# EAGLE schematic EEZ PSU consolidated r5B8 (EAGLE 6.1), part 1 of 2
Assembly variants: Farnell, TME

## Sheet 1 of 12
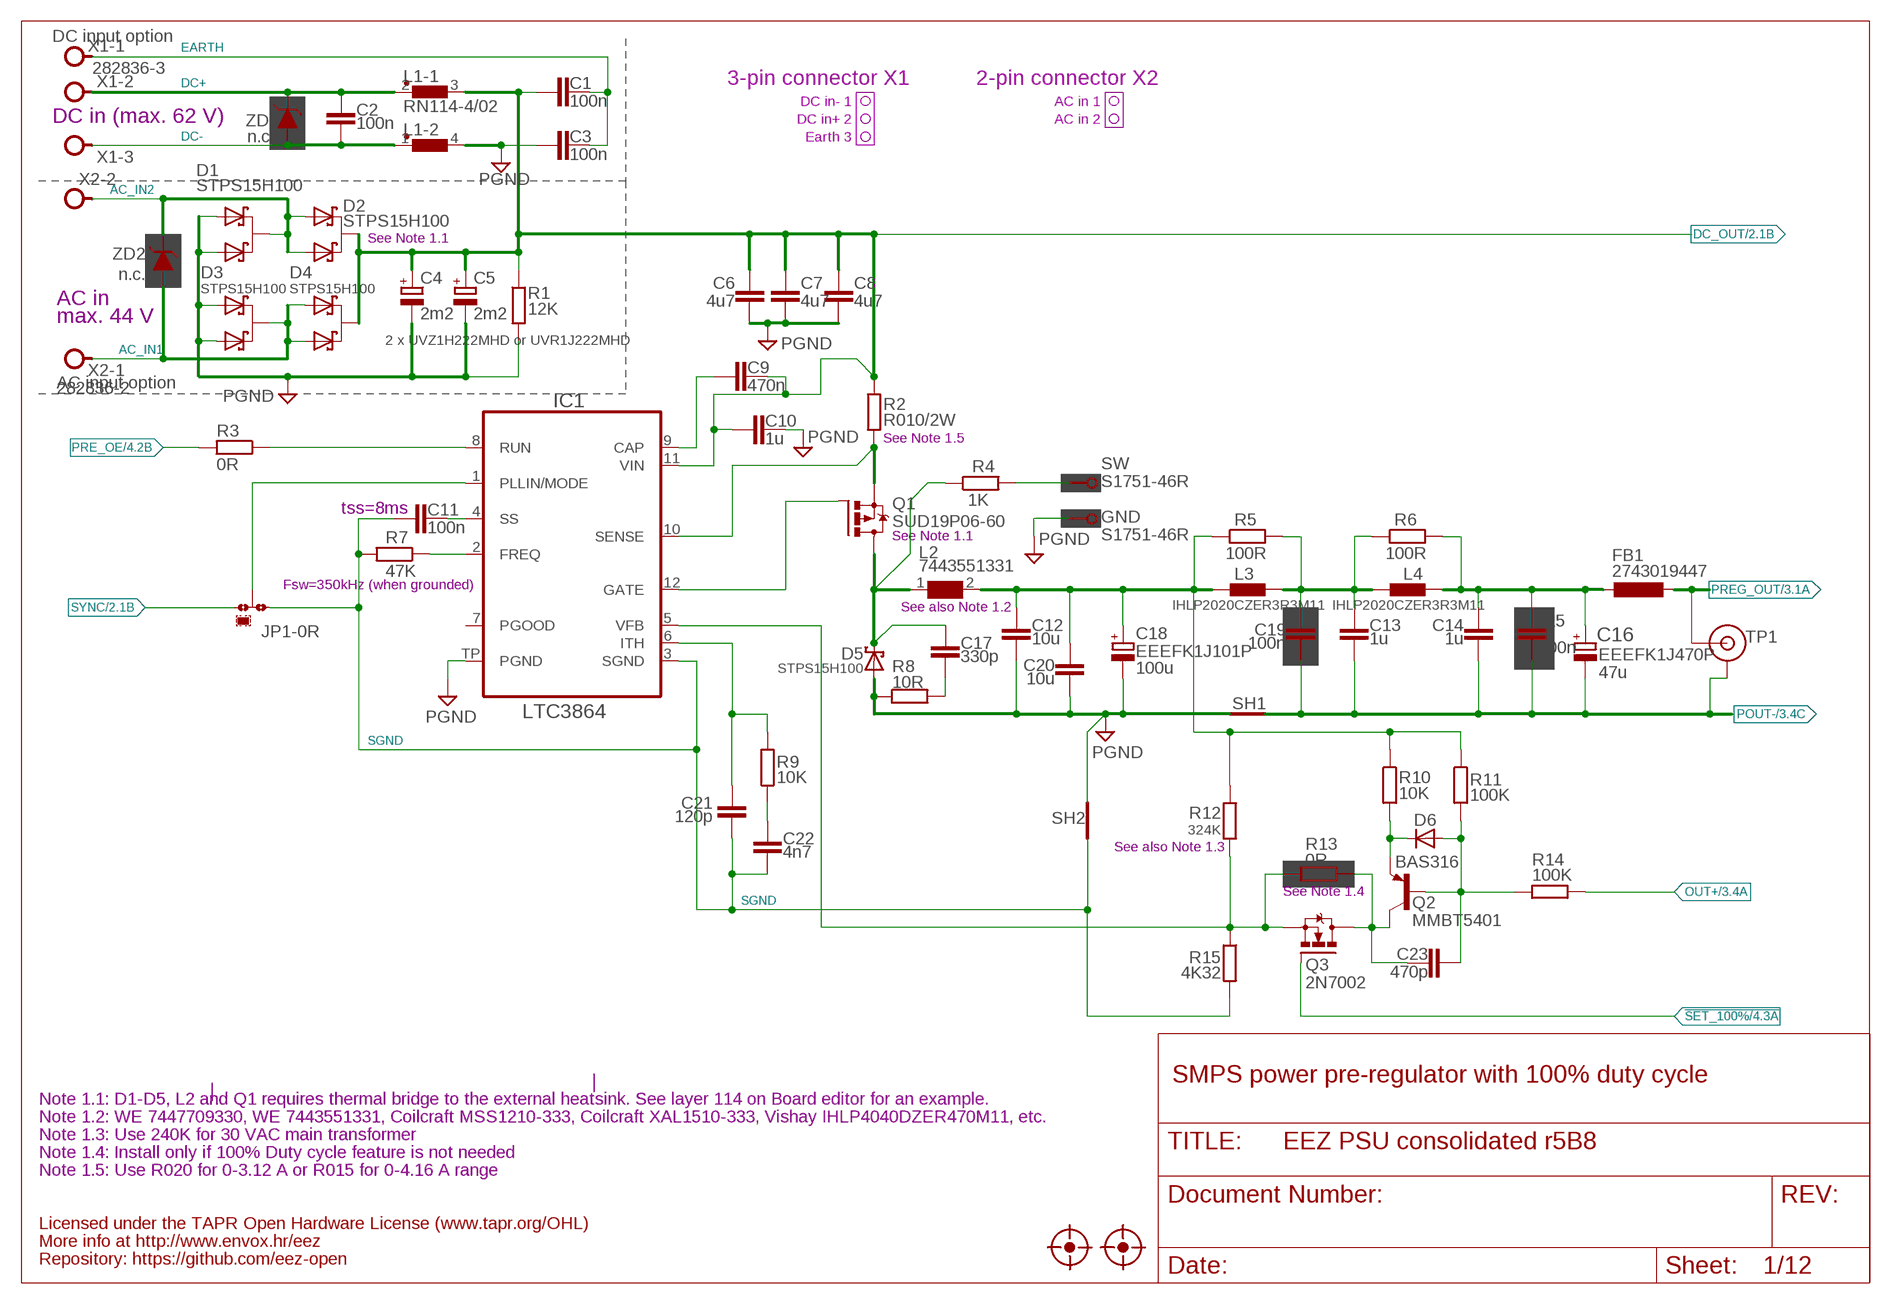
[diagram p0: schematic, sheet 1]

### Parts
C1  100n  C-EUC1206  [C1206]
C2  100n  C-EUC1206  [C1206]
C3  100n  C-EUC1206  [C1206]
C4  2m2  ECAP7.5G_18MM  [ECAP7.5/18]
C5  2m2  ECAP7.5G_18MM  [ECAP7.5/18]
C6  4u7  C-EUC1210  [C1210]
C7  4u7  C-EUC1210  [C1210]
C8  4u7  C-EUC1210  [C1210]
C9  470n  C-EUC0805  [C0805]
C10  1u  C-EUC1206  [C1206]
C11  100n  C-EUC0805  [C0805]
C12  10u  C-EUC1210  [C1210]
C13  1u  C-EUC1206  [C1206]
C14  1u  C-EUC1206  [C1206]
C15  100n  C-EUC0805  [C0805]
C16  EEEFK1J470P  EEE-FK1J470P-CASE-F  [CAPAE830X1050N]
C17  330p  C-EUC0805  [C0805]
C18  EEEFK1J101P  ECAPF  [PANASONIC_F]
C19  100n  C-EUC0805  [C0805]
C20  10u  C-EUC1210  [C1210]
C21  120p  C-EUC0805  [C0805]
C22  4n7  C-EUC0805  [C0805]
C23  470p  C-EUC0805  [C0805]
D1  STPS15H100  VS-6CWQ06FNPBF  [TO252@1]
D2  STPS15H100  VS-6CWQ06FNPBF  [TO252@1]
D3  STPS15H100  VS-6CWQ06FNPBF  [TO252@1]
D4  STPS15H100  VS-6CWQ06FNPBF  [TO252@1]
D5  STPS15H100  SCHOTTKYTO252  [TO252]
D6  BAS316  DIODE-SOD323-W  [SOD323-W]
FB1  2743019447  L-EUL1812  [L1812]
GND  S1751-46R  PCB_TEST_TABSMD  [S1751-46R]
IC1  LTC3864  [LTC_05-08-1666]
JP1  0R-JUMPA  [A0R-JMP]
L1  RN114-4/02  RN114  [RN114]
L2  7443551331  WE-HCI-7443551331_1350/1365  [WE-HCI_1350/1365]
L3  IHLP2020CZER3R3M11  IHLP-2020BZ-11  [IHLP-2020BZ-11]
L4  IHLP2020CZER3R3M11  IHLP-2020BZ-11  [IHLP-2020BZ-11]
Q1  SUD19P06-60  P-MOSFETDPAK  [TO229P990X239-3N]
Q2  MMBT5401  BC857B-PNP-SOT23-BEC  [SOT23-BEC]
Q3  2N7002  [SOT103P240X110-3N]
R1  12K  R-EU_R1206  [R1206]
R2  R010/2W  R-EU_R2512  [R2512]
R3  0R  R-EU_R0805  [R0805]
R4  1K  R-EU_R0805  [R0805]
R5  100R  R-EU_R0805  [R0805]
R6  100R  R-EU_R0805  [R0805]
R7  47K  R-EU_R0805  [R0805]
R8  10R  R-EU_R1206  [R1206]
R9  10K  R-EU_R0805  [R0805]
R10  10K  R-EU_R0805  [R0805]
R11  100K  R-EU_R0805  [R0805]
R12  324K  R-EU_R0805  [R0805]
R13  0R  R-EU_R0805  [R0805]
R14  100K  R-EU_R0805  [R0805]
R15  4K32  R-EU_R0805  [R0805]
SH1  Pgnd to Pout- short  SHORTNOHOLE  [SHORT_NOHOLE]
SH2  Sgnd to Pgnd short  SHORTNOHOLE  [SHORT_NOHOLE]
SW  S1751-46R  PCB_TEST_TABSMD  [S1751-46R]
TP1  TEST_POINT  [TP_1.1MM]
U$11  FIDUCIAL_2  [FIDUCIAL_DUAL]
U$12  FIDUCIAL_2  [FIDUCIAL_DUAL]
X1  282836-3  TBLOCK5.0_3A  [TBLOCK5.0_3]
X2  282836-2  TBLOCK5.0_2A  [TBLOCK5.0_2]
ZD1  n.c.  P6SMB68A  [DO214AA]
ZD2  n.c.  P6SMB68A  [DO214AA]

### Nets
!SET_100%: Q3.1(G) ; also sheet 4
AC_IN1: D3.3(C) D4.1(A1) D4.2(A2) X2.1 ZD2.A
AC_IN2: D1.3(C) D2.1(A1) D2.2(A2) X2.2 ZD2.C
DC+: C2.2 L1.2 X1.2 ZD1.C
DC-: C2.1 L1.1 X1.3 ZD1.A
DC_OUT: C1.2 C4.+ C5.+ C6.1 C7.1 C8.1 C9.2 C10.1 D2.3(C) D4.3(C) IC1.11(VIN) L1.3 R1.1 R2.1 ; also sheet 2,3
EARTH: C1.1 C3.2 X1.1 ; also sheet 8,10
FB: IC1.5(VFB) Q3.2(S) R12.2 R13.2 R15.1
GND [gnd]: C3.1 C4.- C5.- C6.2 C7.2 C8.2 C10.2 C12.2 C18.2(-) C20.2 D1.1(A1) D1.2(A2) D3.1(A1) D3.2(A2) D5.1(A) D5.2(A) GND.P$1 IC1.TP(PGND) L1.4 R1.2 R8.1 SH1.P$2(GND_B) SH2.P$2(GND_B) ; supply symbol labelled PGND ; also sheet 2,3,4,5,6,7,8,9,10,11,12
L_OUT: C12.1 C18.1(+) C20.1 L2.2 L3.1 R5.1 R10.1 R11.1 R12.1
MODE: IC1.1(PLLIN/MODE) JP1.2
N$7: R4.2 SW.P$1
N$19: D6.C Q2.E R10.2
N$20: C21.1 IC1.6(ITH) R9.2
N$21: C22.1 R9.1
N$23: C9.1 IC1.9(CAP)
N$30: IC1.12(GATE) Q1.1(G)
N$31: IC1.2(FREQ) R7.1
N$33: C11.2 IC1.4(SS)
N$34: C23.1 Q2.C Q3.3(D) R13.1
N$35: C13.1 C19.2 L3.2 L4.1 R5.2 R6.1
N$36: IC1.8(RUN) R3.1
N$38: C17.2 R8.2
N$79: C23.2 D6.A Q2.B R11.2 R14.1
OUT+: R14.2 ; also sheet 3,5
P_OUT: C14.1 C15.1 C16.1 FB1.1 L4.2 R6.2
POUT-: C13.2 C14.2 C15.2 C16.2 C19.1 SH1.P$1(GND_A) TP1.GND ; also sheet 3
PRE_OE: R3.2 ; also sheet 4
PREG_OUT: FB1.2 TP1.TIP ; also sheet 3
SENSE: IC1.10(SENSE) Q1.3(S) R2.2
SGND: C11.1 C21.2 C22.2 IC1.3(SGND) JP1.1 R7.2 R15.2 SH2.P$1(GND_A)
SW: C17.1 D5.3(C) L2.1 Q1.2(D) R4.1
SYNC: JP1.3 ; also sheet 2
Unconnected: IC1.7(PGOOD)

### Notes on the sheet
- DC input option
- 3-pin connector X1 | 2-pin connector X2
- DC in- 1 | AC in 1
- DC in+ 2 | AC in 2
- DC in (max. 62 V)
- Earth 3
- See Note 1.1
- AC in
- max. 44 V
- 2 x UVZ1H222MHD or UVR1J222MHD
- AC input option
- See Note 1.5
- tss=8ms
- See Note 1.1
- Fsw=350kHz (when grounded)
- See also Note 1.2
- 100u | 47u
- See also Note 1.3
- See Note 1.4
- SMPS power pre-regulator with 100% duty cycle
- Note 1.1: D1-D5, L2 and Q1 requires thermal bridge to the external heatsink. See layer 114 on Board editor for an example.
- Note 1.2: WE 7447709330, WE 7443551331, Coilcraft MSS1210-333, Coilcraft XAL1510-333, Vishay IHLP4040DZER470M11, etc.
- Note 1.3: Use 240K for 30 VAC main transformer
- Note 1.4: Install only if 100% Duty cycle feature is not needed
- Note 1.5: Use R020 for 0-3.12 A or R015 for 0-4.16 A range
- Licensed under the TAPR Open Hardware License (www.tapr.org/OHL)
- More info at http://www.envox.hr/eez
- Repository: https://github.com/eez-open

## Sheet 2 of 12
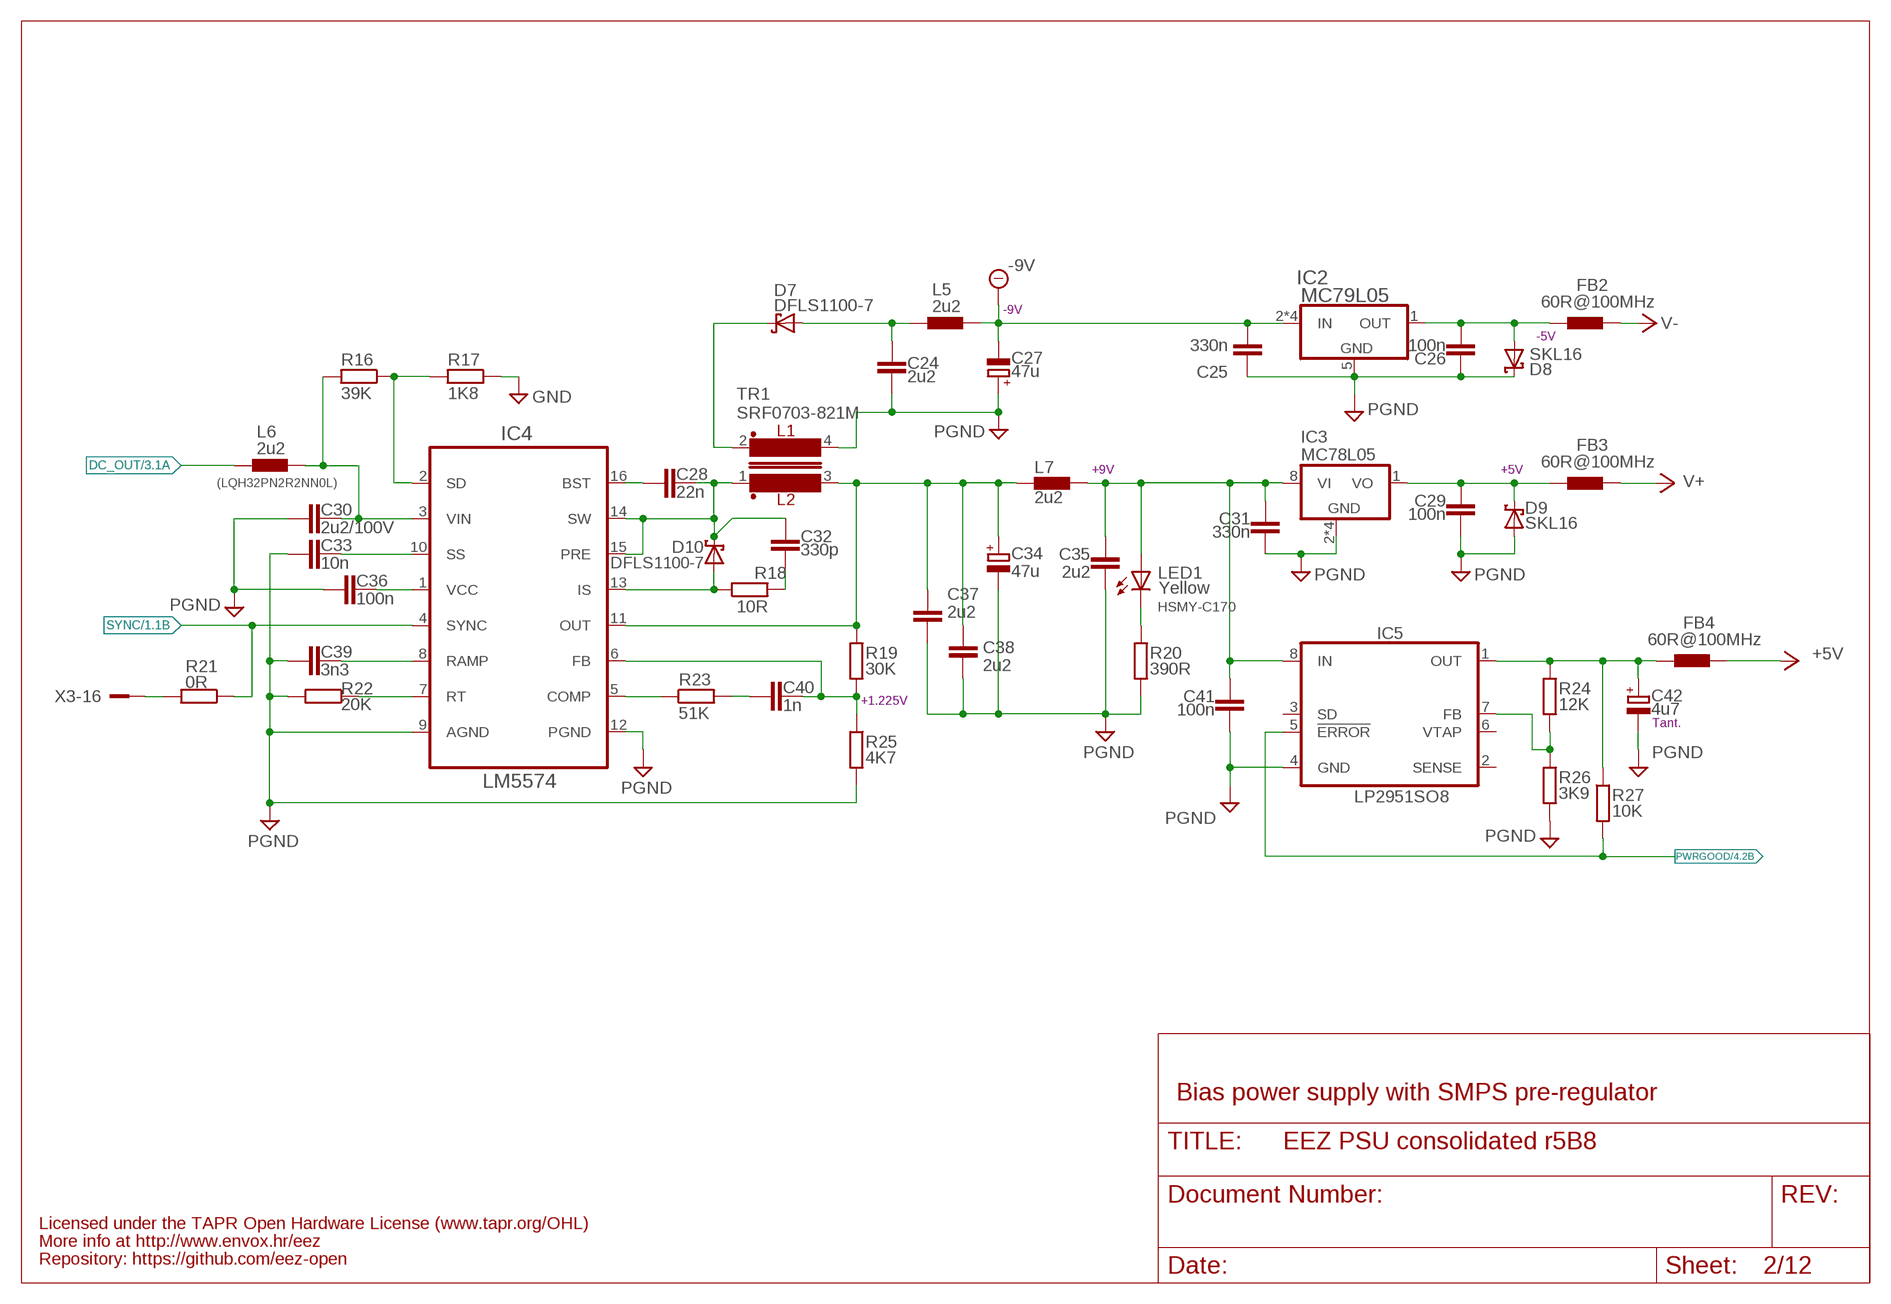
[diagram p1: schematic, sheet 2]

### Parts
C24  2u2  C-EUC0805  [C0805]
C25  330n  C-EUC0805  [C0805]
C26  100n  C-EUC0805  [C0805]
C27  47u  ECAPPANASONIC_H  [CAPAE660X610N]
C28  22n  C-EUC0805  [C0805]
C29  100n  C-EUC0805  [C0805]
C30  2u2/100V  C-EUC1210  [C1210]
C31  330n  C-EUC0805  [C0805]
C32  330p  C-EUC0805  [C0805]
C33  10n  C-EUC0805  [C0805]
C34  47u  ECAPPANASONIC_H  [CAPAE660X610N]
C35  2u2  C-EUC0805  [C0805]  (variant Farnell: 2320829)  (variant TME: CL21B225KAFNNNG )
C36  100n  C-EUC0805  [C0805]
C37  2u2  C-EUC0805  [C0805]  (variant Farnell: 2320829)  (variant TME: CL21B225KAFNNNG )
C38  2u2  C-EUC0805  [C0805]  (variant Farnell: 2320829)  (variant TME: CL21B225KAFNNNG )
C39  3n3  C-EUC0805  [C0805]
C40  1n  C-EUC0805  [C0805]
C41  100n  C-EUC0805  [C0805]
C42  4u7  ECAP1206  [EC1206]
D7  DFLS1100-7  SCHOTTKYSOD123  [SOD123]
D8  SKL16  SCHOTTKYSOD123  [SOD123]
D9  SKL16  SCHOTTKYSOD123  [SOD123]
D10  DFLS1100-7  SCHOTTKYSOD123  [SOD123]
FB2  60R@100MHz  FERRITE_BEAD0603  [BEAD0603]
FB3  60R@100MHz  FERRITE_BEAD0603  [BEAD0603]
FB4  60R@100MHz  FERRITE_BEAD0603  [BEAD0603]
IC2  MC79L05  MC79LXXSOIC  [SOIC127P600X173-8N]
IC3  MC78L05  MC78LXXSOIC8  [SOIC127P600X173-8N]
IC4  LM5574  [SOP65P640X110-16N]
IC5  LP2951SO8  [SOIC127P600X175-8N]
L5  2u2  L1210  [L1210]
L6  2u2  L1210  [L1210]
L7  2u2  L1210  [L1210]
LED1  HSMY-C170  LED0805  [LED_0805]
R16  39K  R-EU_R0805  [R0805]
R17  1K8  R-EU_R0805  [R0805]
R18  10R  R-EU_R1206  [R1206]
R19  30K  R-EU_R0805  [R0805]
R20  390R  R-EU_R0805  [R0805]
R21  0R  R-EU_R0805  [R0805]
R22  20K  R-EU_R0805  [R0805]
R23  51K  R-EU_R0805  [R0805]
R24  12K  R-EU_R0805  [R0805]
R25  4K7  R-EU_R0805  [R0805]
R26  3K9  R-EU_R0805  [R0805]
R27  10K  R-EU_R0805  [R0805]
TR1  SRF0703-821M  BOURNS_SRF0703INV  [SRF0703]
X3  SSW-113-02-T-D-RA  [SSW-113-02-T-D-RA]

### Nets
+5V: FB4.P$2 ; also sheet 3,4,5,6,7,8,9,10,11,12
+VNR: C31.1 C35.1 C41.1 IC3.8(VI) IC5.8(IN) L7.2 LED1.A
-9V: C25.2 C27.2(-) IC2.2(IN) IC2.3(IN) IC2.6(IN) IC2.7(IN) L5.2 ; also sheet 3
DC_OUT: L6.1 ; also sheet 1,3
DC_PREG1: C30.1 IC4.3(VIN) L6.2 R16.2
GND [gnd]: C24.2 C25.1 C26.1 C27.1(+) C29.2 C30.2 C31.2 C33.2 C34.2(-) C35.2 C36.1 C37.2 C38.2 C39.1 C41.2 C42.- D8.C D9.A IC2.5(GND) IC3.2(GND) IC3.3(GND) IC3.6(GND) IC3.7(GND) IC4.9(AGND) IC4.12(PGND) IC5.4(GND) R17.1 R20.2 R22.2 R25.2 R26.2 TR1.4 ; supply symbol labelled PGND ; also sheet 1,3,4,5,6,7,8,9,10,11,12
IS: D10.A IC4.13(IS) R18.1
N$4: C26.2 D8.A FB2.P$1 IC2.1(OUT)
N$5: C29.1 D9.C FB3.P$1 IC3.1(VO)
N$6: C42.+ FB4.P$1 IC5.1(OUT) R24.1 R27.1
N$24: R21.2 X3.16
N$43: LED1.C R20.1
N$46: C32.2 R18.2
N$64: IC5.7(FB) R24.2 R26.1
N$77: C40.2 R23.2
N$128: C40.1 IC4.6(FB) R19.2 R25.1
N$131: C28.2 IC4.16(BST)
N$135: IC4.5(COMP) R23.1
N$165: IC4.7(RT) R22.1
N$166: C36.2 IC4.1(VCC)
N$167: C39.2 IC4.8(RAMP)
N$168: C33.1 IC4.10(SS)
N$179: C24.1 D7.A L5.1
N$180: IC4.2(SD) R16.1 R17.2
PWRGOOD: IC5.5(!ERROR) R27.2 ; also sheet 4
SW1: C28.1 C32.1 D10.C IC4.14(SW) IC4.15(PRE) TR1.1
SYNC: IC4.4(SYNC) R21.1 ; also sheet 1
V+: FB3.P$2 ; also sheet 3,4,5
V-: FB2.P$2 ; also sheet 3,4,5
VOUT+: C34.1(+) C37.1 C38.1 IC4.11(OUT) L7.1 R19.1 TR1.3
VOUT-: D7.C TR1.2
Unconnected: IC5.2(SENSE) IC5.3(SD) IC5.6(VTAP)

### Notes on the sheet
- -9V
- -5V
- +9V | +5V
- (LQH32PN2R2NN0L)
- Yellow
- +1.225V
- Tant.
- Bias power supply with SMPS pre-regulator
- Licensed under the TAPR Open Hardware License (www.tapr.org/OHL)
- More info at http://www.envox.hr/eez
- Repository: https://github.com/eez-open

## Sheet 3 of 12
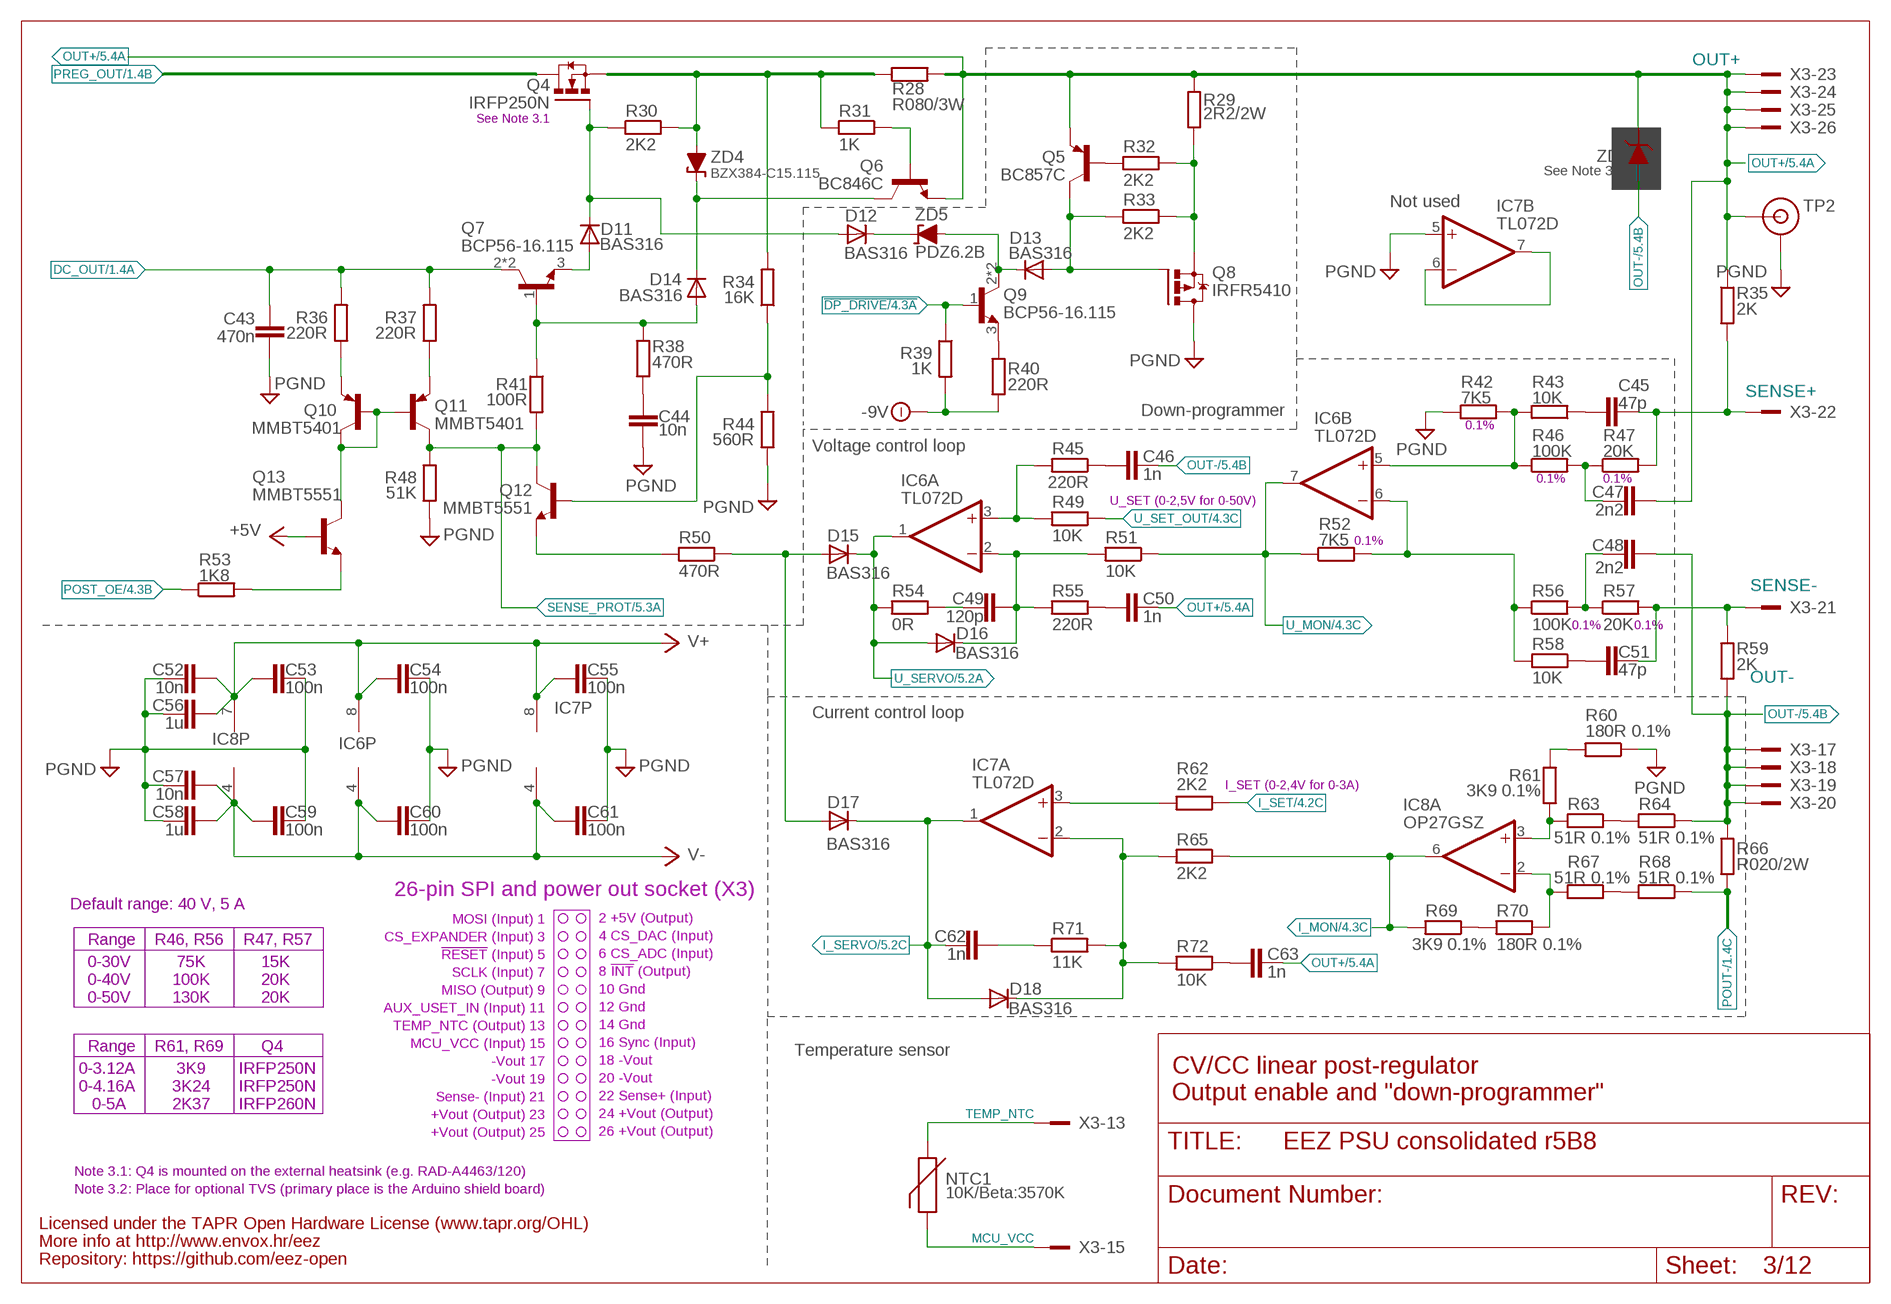
[diagram p2: schematic, sheet 3]

### Parts
C43  470n  C-EUC1812  [C1812]
C44  10n  C-EUC0805  [C0805]
C45  47p  C-EUC0805  [C0805]
C46  1n  C-EUC0805  [C0805]
C47  2n2  C-EUC0805  [C0805]
C48  2n2  C-EUC0805  [C0805]
C49  120p  C-EUC0805  [C0805]
C50  1n  C-EUC0805  [C0805]
C51  47p  C-EUC0805  [C0805]
C52  10n  C-EUC0805  [C0805]
C53  100n  C-EUC0603  [C0603]
C54  100n  C-EUC0603  [C0603]
C55  100n  C-EUC0603  [C0603]
C56  1u  C-EUC0805  [C0805]
C57  10n  C-EUC0805  [C0805]
C58  1u  C-EUC0805  [C0805]
C59  100n  C-EUC0603  [C0603]
C60  100n  C-EUC0603  [C0603]
C61  100n  C-EUC0603  [C0603]
C62  1n  C-EUC0805  [C0805]
C63  1n  C-EUC0805  [C0805]
D11  BAS316  DIODE-SOD323-W  [SOD323-W]
D12  BAS316  DIODE-SOD323-W  [SOD323-W]
D13  BAS316  DIODE-SOD323-W  [SOD323-W]
D14  BAS316  DIODE-SOD323-W  [SOD323-W]
D15  BAS316  DIODE-SOD323-W  [SOD323-W]
D16  BAS316  DIODE-SOD323-W  [SOD323-W]
D17  BAS316  DIODE-SOD323-W  [SOD323-W]
D18  BAS316  DIODE-SOD323-W  [SOD323-W]
IC6  TL072D  TL072SOIC8  [SOIC127P600X173-8N]
IC7  TL072D  TL072SOIC8  [SOIC127P600X173-8N]
IC8  OP27GSZ  OP27GSZSO8  [SOIC127P600X173-8N]
NTC1  10K/Beta:3570K  NTC0805  [R_0204/5+0805]
Q4  IRFP250N  IRFP240BOTTOM  [TO247BH-CLR]
Q5  BC857C  BC857C-PNP-SOT23-BEC  [SOT23-BEC]
Q6  BC846C  BC846B-NPN-SOT23-BEC  [SOT23-BEC]
Q7  BCP56-16.115  BCP56  [SOT230P700X180-4N]
Q8  IRFR5410  P-MOSFETDPAK  [TO229P990X239-3N]
Q9  BCP56-16.115  BCP56  [SOT230P700X180-4N]
Q10  MMBT5401  BC857B-PNP-SOT23-BEC  [SOT23-BEC]
Q11  MMBT5401  BC857B-PNP-SOT23-BEC  [SOT23-BEC]
Q12  MMBT5551  MMBT5551LT1-NPN-SOT23-BEC  [SOT23-BEC]
Q13  MMBT5551  MMBT5551LT1-NPN-SOT23-BEC  [SOT23-BEC]
R28  R080/3W  R-EU_R2512  [R2512]
R29  2R2/2W  R-EU_R2512  [R2512]
R30  2K2  R-EU_R0805  [R0805]
R31  1K  R-EU_R0805  [R0805]
R32  2K2  R-EU_R0805  [R0805]
R33  2K2  R-EU_R0805  [R0805]
R34  16K  R-EU_R0805  [R0805]
R35  2K  R-EU_R0805  [R0805]
R36  220R  R-EU_R0805  [R0805]
R37  220R  R-EU_R0805  [R0805]
R38  470R  R-EU_R0805  [R0805]
R39  1K  R-EU_R0805  [R0805]
R40  220R  R-EU_R0805  [R0805]
R41  100R  R-EU_R0805  [R0805]
R42  7K5  R-EU_R0805  [R0805]
R43  10K  R-EU_R0805  [R0805]
R44  560R  R-EU_R0805  [R0805]
R45  220R  R-EU_R0805  [R0805]
R46  100K  R-EU_R0805  [R0805]
R47  20K  R-EU_R0805  [R0805]
R48  51K  R-EU_R0805  [R0805]
R49  10K  R-EU_R0805  [R0805]
R50  470R  R-EU_R0805  [R0805]
R51  10K  R-EU_R0805  [R0805]
R52  7K5  R-EU_R0805  [R0805]
R53  1K8  R-EU_R0805  [R0805]
R54  0R  R-EU_R0805  [R0805]
R55  220R  R-EU_R0805  [R0805]
R56  100K  R-EU_R0805  [R0805]
R57  20K  R-EU_R0805  [R0805]
R58  10K  R-EU_R0805  [R0805]
R59  2K  R-EU_R0805  [R0805]
R60  180R 0.1%  R-EU_R0805  [R0805]
R61  3K9 0.1%  R-EU_R0805  [R0805]
R62  2K2  R-EU_R0805  [R0805]
R63  51R 0.1%  R-EU_R0805  [R0805]
R64  51R 0.1%  R-EU_R0805  [R0805]
R65  2K2  R-EU_R0805  [R0805]
R66  R020/2W  R-EU_R2512  [R2512]
R67  51R 0.1%  R-EU_R0805  [R0805]
R68  51R 0.1%  R-EU_R0805  [R0805]
R69  3K9 0.1%  R-EU_R0805  [R0805]
R70  180R 0.1%  R-EU_R0805  [R0805]
R71  11K  R-EU_R0805  [R0805]
R72  10K  R-EU_R0805  [R0805]
TP2  TEST_POINT  [TP_1.1MM]
ZD3  See Note 3.2  P6SMB68A  [DO214AA]
ZD4  BZX384-C15.115  ZENER-DIODESOD323  [SOD323-W]
ZD5  PDZ6.2B  ZENER-DIODESOD323  [SOD323-W]

### Nets
!DP_DRIVE: Q9.1(B) R39.1 ; also sheet 4
+5V: Q13.B ; also sheet 2,4,5,6,7,8,9,10,11,12
-9V: R39.2 R40.2 ; also sheet 2
DC_OUT: C43.1 Q7.2(C) Q7.4(C) R36.2 R37.2 ; also sheet 1,2
GND [gnd]: C43.2 C44.2 C52.1 C53.2 C54.1 C55.1 C56.1 C57.1 C58.1 C59.2 C60.1 C61.1 IC7.5(B:+IN) Q8.2(D) R42.1 R44.1 R48.1 R60.1 TP2.GND ; supply symbol labelled PGND ; also sheet 1,2,4,5,6,7,8,9,10,11,12
I_MON: IC8.6(A:OUT) R65.1 R69.2 ; also sheet 4
I_SERVO: C62.2 D17.C D18.A IC7.1(A:OUT) ; also sheet 5
I_SET: R62.1 ; also sheet 4
ISENSE+: IC8.3(A:+IN) R61.2 R63.2
ISENSE-: IC8.2(A:-IN) R67.2 R70.1
MCU_VCC: NTC1.2 NTC1.2.1 X3.15
N$1: Q9.3(E) R40.1
N$2: Q5.B R32.2
N$3: C45.2 R43.1
N$8: R63.1 R64.2
N$10: C51.2 R58.1
N$13: R67.1 R68.2
N$14: R69.1 R70.2
N$15: R60.2 R61.1
N$16: IC7.6(B:-IN) IC7.7(B:OUT)
N$17: C48.1 R56.2 R57.1
N$18: C49.2 R54.1
N$22: C63.2 R72.1
N$26: C46.2 R45.1
N$27: C50.2 R55.1
N$29: IC6.3(A:+IN) R45.2 R49.2
N$32: C49.1 D16.C IC6.2(A:-IN) R51.2 R55.2
N$37: D18.C IC7.2(A:-IN) R65.2 R71.2 R72.2
N$44: Q12.B R34.1 R44.2
N$50: IC7.3(A:+IN) R62.2
N$54: D15.A D17.A R50.1
N$56: D11.C D12.A Q4.G R30.1
N$62: D11.A Q7.3(E)
N$65: D14.A Q7.1(B) R38.2 R41.1
N$67: C44.1 R38.1
N$117: C47.1 R46.2 R47.1
N$129: D14.C Q6.C ZD4.C
N$143: D12.C ZD5.C
N$145: Q12.E R50.2
N$146: Q8.3(S) R29.1 R32.1 R33.1
N$147: D13.A Q5.C Q8.1(G) R33.2
N$150: IC6.5(B:+IN) R42.2 R43.2 R46.1
N$158: IC6.6(B:-IN) R52.2 R56.1 R58.2
N$172: C62.1 R71.1
N$183: Q11.E R37.1
N$184: Q10.E R36.1
N$186: Q13.E R53.2
N$201: Q6.B R31.1
OUT+: C47.2 C50.1 C63.1 Q5.E Q6.E R28.2 R29.2 R35.1 TP2.TIP X3.23 X3.24 X3.25 X3.26 ZD3.C ; also sheet 1,5
OUT-: C46.1 C48.2 R59.2 R64.1 R66.1 X3.17 X3.18 X3.19 X3.20 ZD3.A ; also sheet 5
POST_OE: R53.1 ; also sheet 4
POUT-: R66.2 R68.1 ; also sheet 1
PREG_OUT: Q4.D ; also sheet 1
Q4_OUT: Q4.S R28.1 R30.2 R31.2 R34.2 ZD4.A
Q7C: Q10.B Q10.C Q11.B Q13.C
Q9C: D13.C Q9.2(C) Q9.4(C) ZD5.A
SENSE+: C45.1 R35.2 R47.2 X3.22 ; also sheet 5
SENSE-: C51.1 R57.2 R59.1 X3.21 ; also sheet 5
SENSE_PROT: Q11.C Q12.C R41.2 R48.2 ; also sheet 5
TEMP_NTC: NTC1.1 NTC1.1.1 X3.13
U_MON: IC6.7(B:OUT) R51.1 R52.1 ; also sheet 4
U_SERVO: D15.C D16.A IC6.1(A:OUT) R54.2 ; also sheet 5
U_SET_OUT: R49.1 ; also sheet 4
V+: C52.2 C53.1 C54.2 C55.2 C56.2 IC6.8(P:V+) IC7.8(P:V+) IC8.7(P:V+) ; also sheet 2,4,5
V-: C57.2 C58.2 C59.1 C60.2 C61.2 IC6.4(P:V-) IC7.4(P:V-) IC8.4(P:V-) ; also sheet 2,4,5

### Notes on the sheet
- See Note 3.1
- Not used
- Down-programmer
- 0.1%
- Voltage control loop
- 0.1% | 0.1%
- U_SET (0-2,5V for 0-50V)
- 0.1%
- 0.1% | 0.1%
- Current control loop
- I_SET (0-2,4V for 0-3A)
- 26-pin SPI and power out socket (X3)
- Default range: 40 V, 5 A
- MOSI (Input) 1
- 2 +5V (Output)
- CS_EXPANDER (Input) 3
- 4 CS_DAC (Input)
- Range | R46, R56 | R47, R57
- !RESET! (Input) 5
- 6 CS_ADC (Input)
- 0-30V | 75K | 15K | SCLK (Input) 7
- 8 !INT! (Output)
- 0-40V | 100K | 20K | MISO (Output) 9
- 10 Gnd
- 0-50V | 130K | 20K | AUX_USET_IN (Input) 11
- 12 Gnd
- TEMP_NTC (Output) 13
- 14 Gnd
- MCU_VCC (Input) 15
- 16 Sync (Input)
- Range | R61, R69 | Q4
- -Vout 17 | Temperature sensor
- 18 -Vout
- 0-3.12A | 3K9 | IRFP250N | -Vout 19 | CV/CC linear post-regulator
- 20 -Vout
- 0-4.16A | 3K24 | IRFP250N | Sense- (Input) 21
- 22 Sense+ (Input) | Output enable and "down-programmer"
- 0-5A | 2K37 | IRFP260N | +Vout (Output) 23
- 24 +Vout (Output)
- +Vout (Output) 25
- 26 +Vout (Output)
- Note 3.1: Q4 is mounted on the external heatsink (e.g. RAD-A4463/120)
- Note 3.2: Place for optional TVS (primary place is the Arduino shield board)
- Licensed under the TAPR Open Hardware License (www.tapr.org/OHL)
- More info at http://www.envox.hr/eez
- Repository: https://github.com/eez-open

## Sheet 4 of 12
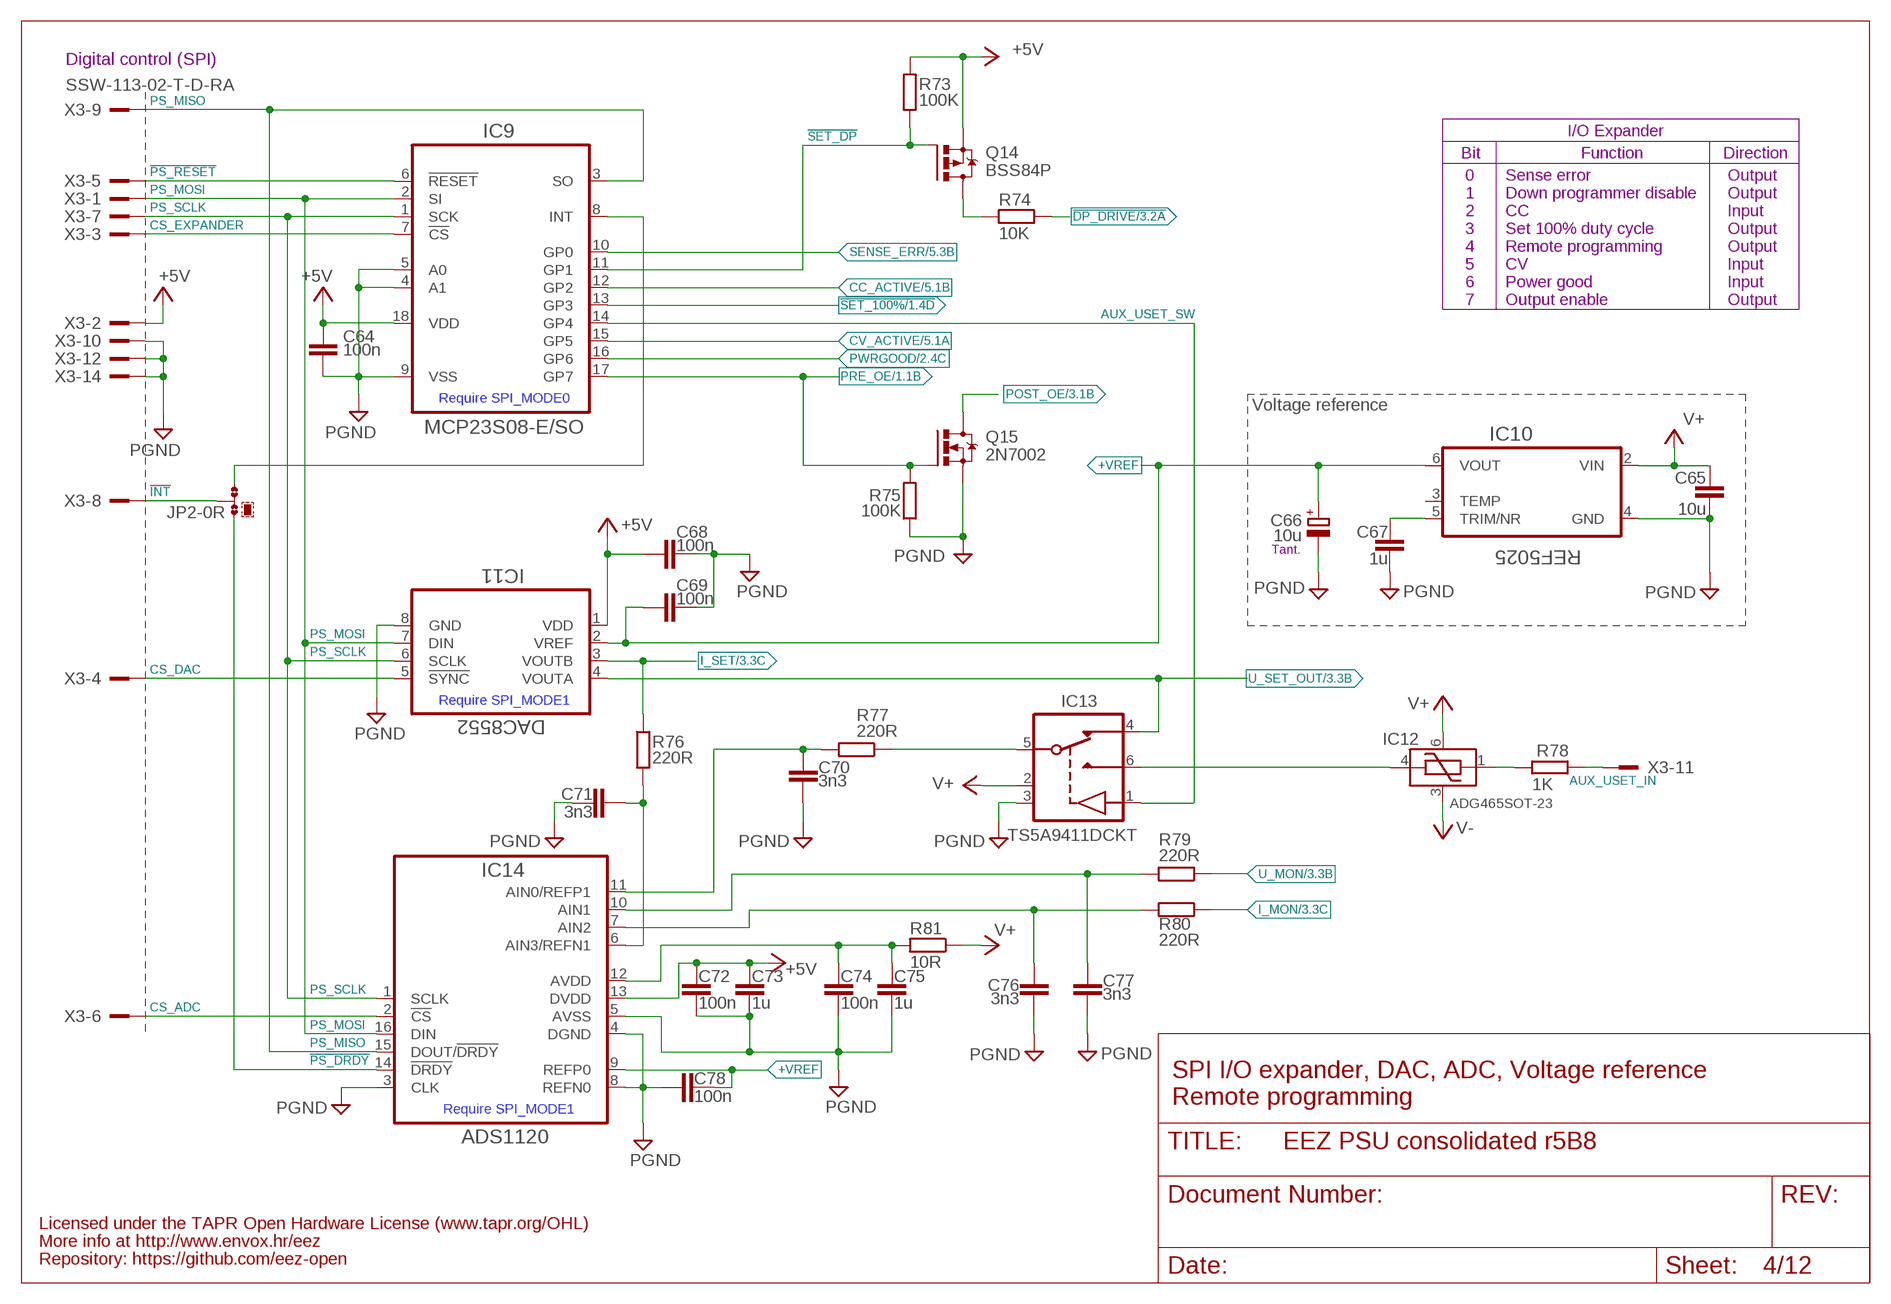
[diagram p3: schematic, sheet 4]

### Parts
C64  100n  C-EUC0603  [C0603]
C65  10u  C-EUC1206  [C1206]
C66  10u  ECAP1206  [EC1206]
C67  1u  C-EUC0805  [C0805]
C68  100n  C-EUC0603  [C0603]
C69  100n  C-EUC0603  [C0603]
C70  3n3  C-EUC0805  [C0805]
C71  3n3  C-EUC0805  [C0805]
C72  100n  C-EUC0603  [C0603]
C73  1u  C-EUC0805  [C0805]
C74  100n  C-EUC0603  [C0603]
C75  1u  C-EUC0805  [C0805]
C76  3n3  C-EUC0805  [C0805]
C77  3n3  C-EUC0805  [C0805]
C78  100n  C-EUC0603  [C0603]
IC9  MCP23S08-E/SO  MCP23S08  [SOIC127P1030X265-18N]
IC10  REF5025  REF50XX  [SOIC127P600X175-8N]
IC11  DAC8552  DAC8552_DGK_8M  [DGK8-M]
IC12  ADG465SOT-23  [SOT95P280X145-6N]
IC13  TS5A9411DCKT  [SOT65P210X110-6N]
IC14  ADS1120  ADS1120TSSOP-16  [PW(R-PDSO-G16)]
JP2  0R-JUMPA  [A0R-JMP]
Q14  BSS84P  IRLML2246TRPBF  [SOT95P237X112-3N]
Q15  2N7002  [SOT103P240X110-3N]
R73  100K  R-EU_R0805  [R0805]
R74  10K  R-EU_R0805  [R0805]
R75  100K  R-EU_R0805  [R0805]
R76  220R  R-EU_R0805  [R0805]
R77  220R  R-EU_R0805  [R0805]
R78  1K  R-EU_R0805  [R0805]
R79  220R  R-EU_R0805  [R0805]
R80  220R  R-EU_R0805  [R0805]
R81  10R  R-EU_R0805  [R0805]

### Nets
!DP_DRIVE: R74.1 ; also sheet 3
!INT: JP2.2 X3.8
!PS_DRDY: IC14.14(!DRDY) JP2.3
!PS_RESET: IC9.6(!RESET) X3.5
!SET_100%: IC9.13(GP3) ; also sheet 1
!SET_DP: IC9.11(GP1) Q14.1(G) R73.2
+5V: C64.1 C68.2 C72.2 C73.2 IC9.18(VDD) IC11.1(VDD) IC14.13(DVDD) Q14.2(S) R73.1 X3.2 ; also sheet 2,3,5,6,7,8,9,10,11,12
+VREF: C66.+ C69.2 C78.2 IC10.6(VOUT) IC11.2(VREF) IC14.9(REFP0)
AUX_USET_IN: R78.2 X3.11
AUX_USET_SW: IC9.14(GP4) IC13.1(IN)
CC_ACTIVE: IC9.12(GP2) ; also sheet 5
CS_ADC: IC14.2(!CS) X3.6
CS_DAC: IC11.5(!SYNC) X3.4
CS_EXPANDER: IC9.7(!CS) X3.3
CV_ACTIVE: IC9.15(GP5) ; also sheet 5
DP_LED: Q14.3(D) R74.2
GND [gnd]: C64.2 C65.2 C66.- C67.2 C68.1 C69.1 C70.1 C71.2 C72.1 C73.1 C74.1 C75.1 C76.1 C77.1 C78.1 IC9.4(A1) IC9.5(A0) IC9.9(VSS) IC10.4(GND) IC11.8(GND) IC13.3(GND) IC14.3(CLK) IC14.4(DGND) IC14.5(AVSS) IC14.8(REFN0) Q15.2(S) R75.1 X3.10 X3.12 X3.14 ; supply symbol labelled PGND ; also sheet 1,2,3,5,6,7,8,9,10,11,12
I_MON: R80.1 ; also sheet 3
I_SET: IC11.3(VOUTB) R76.1 ; also sheet 3
INT_EXP: IC9.8(INT) JP2.1
N$9: IC12.4(VS) IC13.6(S1)
N$11: C67.1 IC10.5(TRIM/NR)
N$12: IC12.1(VD) R78.1
N$28: C77.2 IC14.10(AIN1) R79.2
N$41: C70.2 IC14.11(AIN0/REFP1) R77.2
N$42: C74.2 C75.2 IC14.12(AVDD) R81.2
N$51: C71.1 IC14.6(AIN3/REFN1) R76.2
N$55: C76.2 IC14.7(AIN2) R80.2
POST_OE: Q15.3(D) ; also sheet 3
PRE_OE: IC9.17(GP7) Q15.1(G) R75.2 ; also sheet 1
PS_MISO: IC9.3(SO) IC14.15(DOUT/!DRDY) X3.9
PS_MOSI: IC9.2(SI) IC11.7(DIN) IC14.16(DIN) X3.1
PS_SCLK: IC9.1(SCK) IC11.6(SCLK) IC14.1(SCLK) X3.7
PWRGOOD: IC9.16(GP6) ; also sheet 2
SENSE_ERR: IC9.10(GP0) ; also sheet 5
U_MON: R79.1 ; also sheet 3
U_SET: IC13.5(D) R77.1
U_SET_OUT: IC11.4(VOUTA) IC13.4(S2) ; also sheet 3
V+: C65.1 IC10.2(VIN) IC12.6(VDD) IC13.2(VDD) R81.1 ; also sheet 2,3,5
V-: IC12.3(VSS) ; also sheet 2,3,5
Unconnected: IC10.3(TEMP)

### Notes on the sheet
- Digital control (SPI)
- I/O Expander
- Bit | Function | Direction
- 0 | Sense error | Output
- 1 | Down programmer disable | Output
- 2 | CC | Input
- 3 | Set 100% duty cycle | Output
- 4 | Remote programming | Output
- 5 | CV | Input
- 6 | Power good | Input
- 7 | Output enable | Output
- Voltage reference
- Require SPI_MODE0
- Tant.
- Require SPI_MODE1
- SPI I/O expander, DAC, ADC, Voltage reference
- Remote programming
- Require SPI_MODE1
- Licensed under the TAPR Open Hardware License (www.tapr.org/OHL)
- More info at http://www.envox.hr/eez
- Repository: https://github.com/eez-open

## Sheet 5 of 12
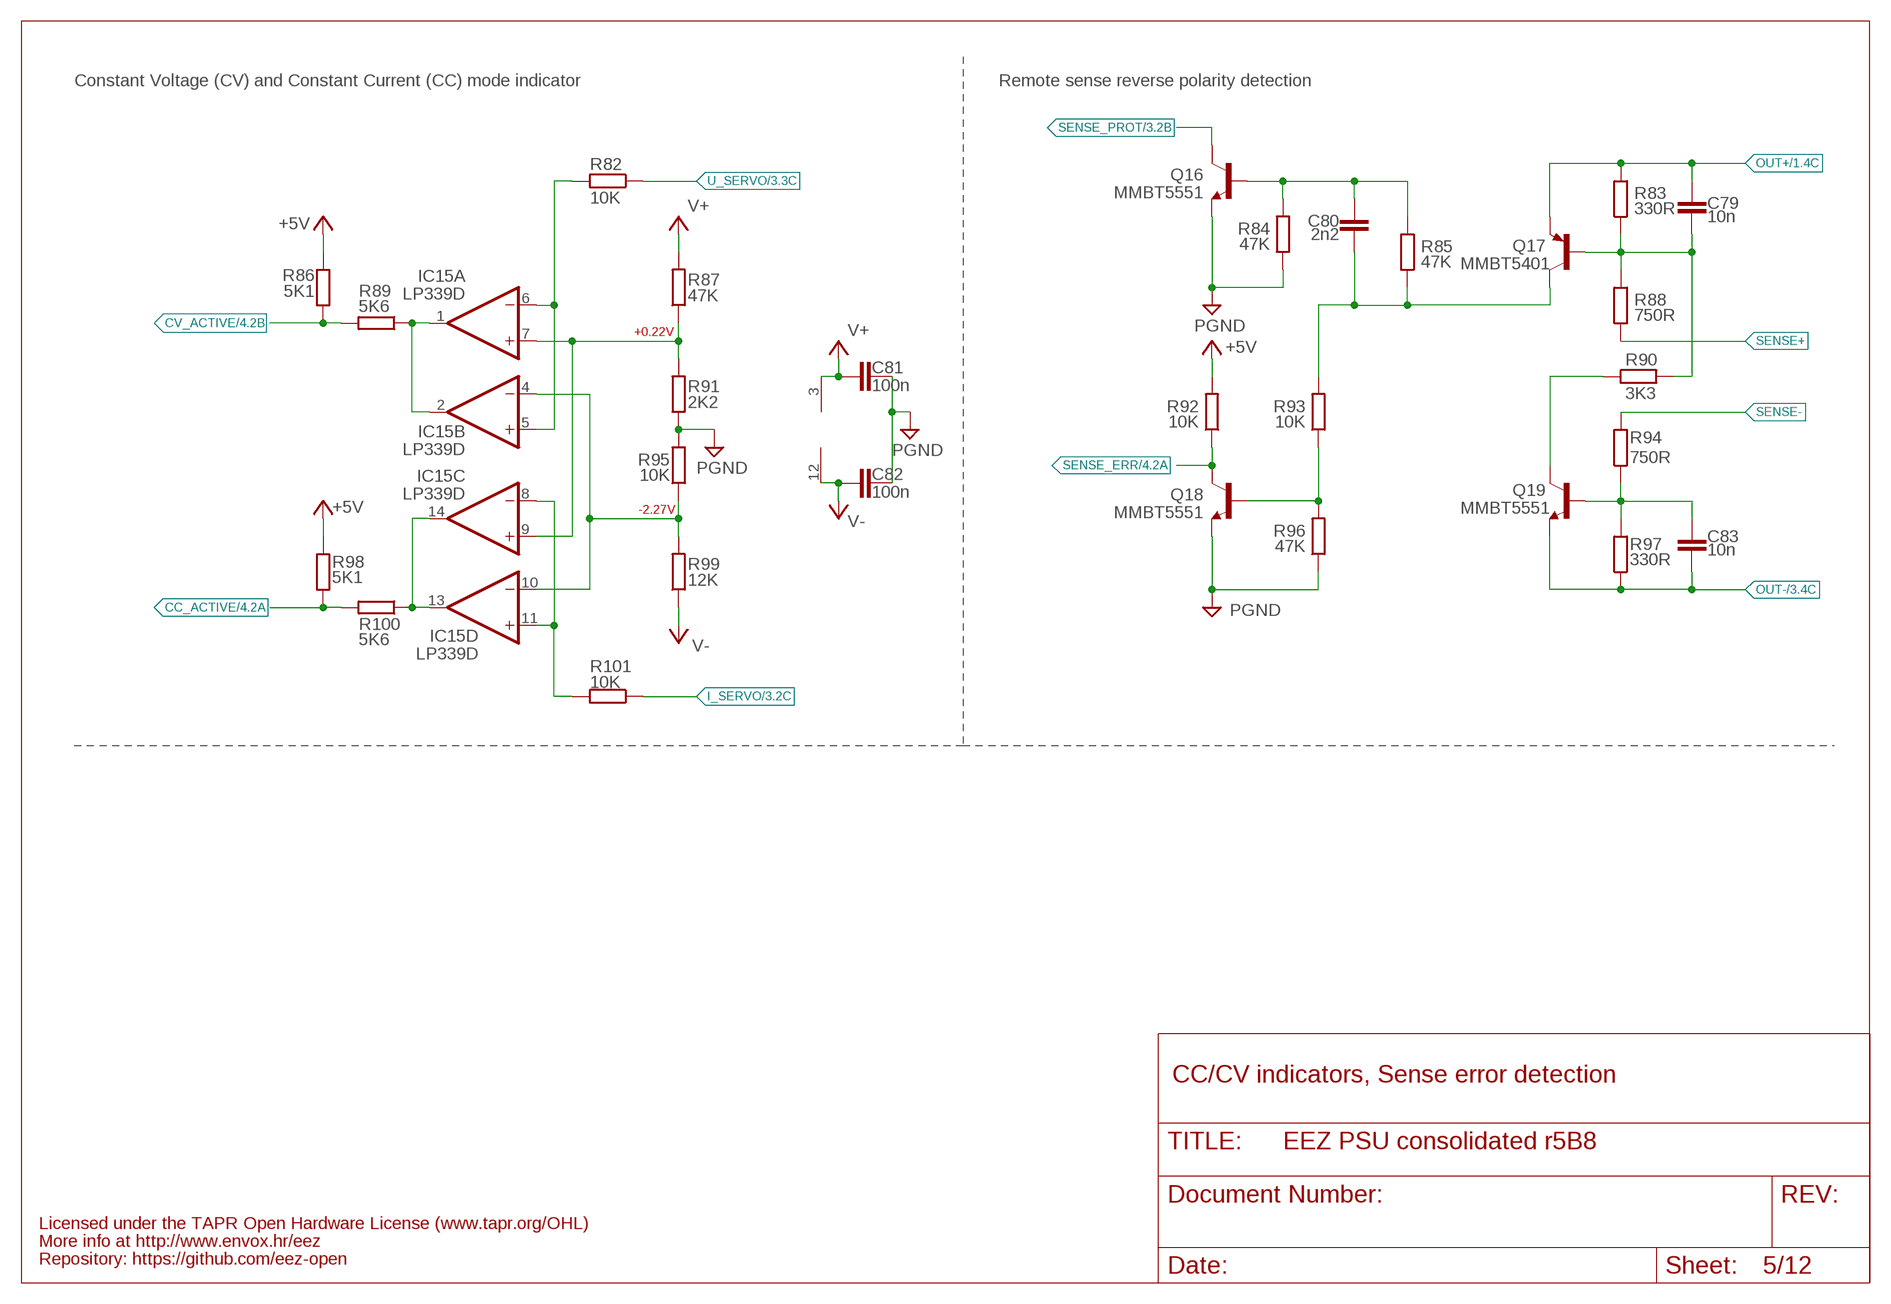
[diagram p4: schematic, sheet 5]

### Parts
C79  10n  C-EUC0805  [C0805]
C80  2n2  C-EUC0805  [C0805]
C81  100n  C-EUC0603  [C0603]
C82  100n  C-EUC0603  [C0603]
C83  10n  C-EUC0805  [C0805]
IC15  LP339D  LM339SO14  [SOIC127P600X175-14N]
Q16  MMBT5551  MMBT5551LT1-NPN-SOT23-BEC  [SOT23-BEC]
Q17  MMBT5401  BC857B-PNP-SOT23-BEC  [SOT23-BEC]
Q18  MMBT5551  MMBT5551LT1-NPN-SOT23-BEC  [SOT23-BEC]
Q19  MMBT5551  MMBT5551LT1-NPN-SOT23-BEC  [SOT23-BEC]
R82  10K  R-EU_R0805  [R0805]
R83  330R  R-EU_R0805  [R0805]
R84  47K  R-EU_R0805  [R0805]
R85  47K  R-EU_R0805  [R0805]
R86  5K1  R-EU_R0805  [R0805]
R87  47K  R-EU_R0805  [R0805]
R88  750R  R-EU_R0805  [R0805]
R89  5K6  R-EU_R0805  [R0805]
R90  3K3  R-EU_R0805  [R0805]
R91  2K2  R-EU_R0805  [R0805]
R92  10K  R-EU_R0805  [R0805]
R93  10K  R-EU_R0805  [R0805]
R94  750R  R-EU_R0805  [R0805]
R95  10K  R-EU_R0805  [R0805]
R96  47K  R-EU_R0805  [R0805]
R97  330R  R-EU_R0805  [R0805]
R98  5K1  R-EU_R0805  [R0805]
R99  12K  R-EU_R0805  [R0805]
R100  5K6  R-EU_R0805  [R0805]
R101  10K  R-EU_R0805  [R0805]

### Nets
+5V: R86.2 R92.2 R98.2 ; also sheet 2,3,4,6,7,8,9,10,11,12
CC_ACTIVE: R98.1 R100.2 ; also sheet 4
CV_ACTIVE: R86.1 R89.2 ; also sheet 4
GND [gnd]: C81.1 C82.1 Q16.E Q18.E R84.1 R91.1 R95.2 R96.1 ; supply symbol labelled PGND ; also sheet 1,2,3,4,6,7,8,9,10,11,12
I_SERVO: R101.1 ; also sheet 3
N$25: C79.2 Q17.B R83.1 R88.2 R90.2
N$39: Q18.B R93.1 R96.2
N$40: C80.2 Q17.C R85.1 R93.2
N$45: IC15.1(A:OUT) IC15.2(B:OUT) R89.1
N$47: Q19.C R90.1
N$48: IC15.13(D:OUT) IC15.14(C:OUT) R100.1
N$49: C83.1 Q19.B R94.1 R97.2
N$53: C80.1 Q16.B R84.2 R85.2
N$153: IC15.5(B:+IN) IC15.6(A:-IN) R82.2
N$161: IC15.8(C:-IN) IC15.11(D:+IN) R101.2
N$170: IC15.7(A:+IN) IC15.9(C:+IN) R87.1 R91.2
N$177: IC15.4(B:-IN) IC15.10(D:-IN) R95.1 R99.2
OUT+: C79.1 Q17.E R83.2 ; also sheet 1,3
OUT-: C83.2 Q19.E R97.1 ; also sheet 3
SENSE+: R88.1 ; also sheet 3
SENSE-: R94.2 ; also sheet 3
SENSE_ERR: Q18.C R92.1 ; also sheet 4
SENSE_PROT: Q16.C ; also sheet 3
U_SERVO: R82.1 ; also sheet 3
V+: C81.2 IC15.3(P:V+) R87.2 ; also sheet 2,3,4
V-: C82.2 IC15.12(P:GND) R99.1 ; also sheet 2,3,4

### Notes on the sheet
- Constant Voltage (CV) and Constant Current (CC) mode indicator | Remote sense reverse polarity detection
- +0.22V
- -2.27V
- CC/CV indicators, Sense error detection
- Licensed under the TAPR Open Hardware License (www.tapr.org/OHL)
- More info at http://www.envox.hr/eez
- Repository: https://github.com/eez-open

## Sheet 6 of 12
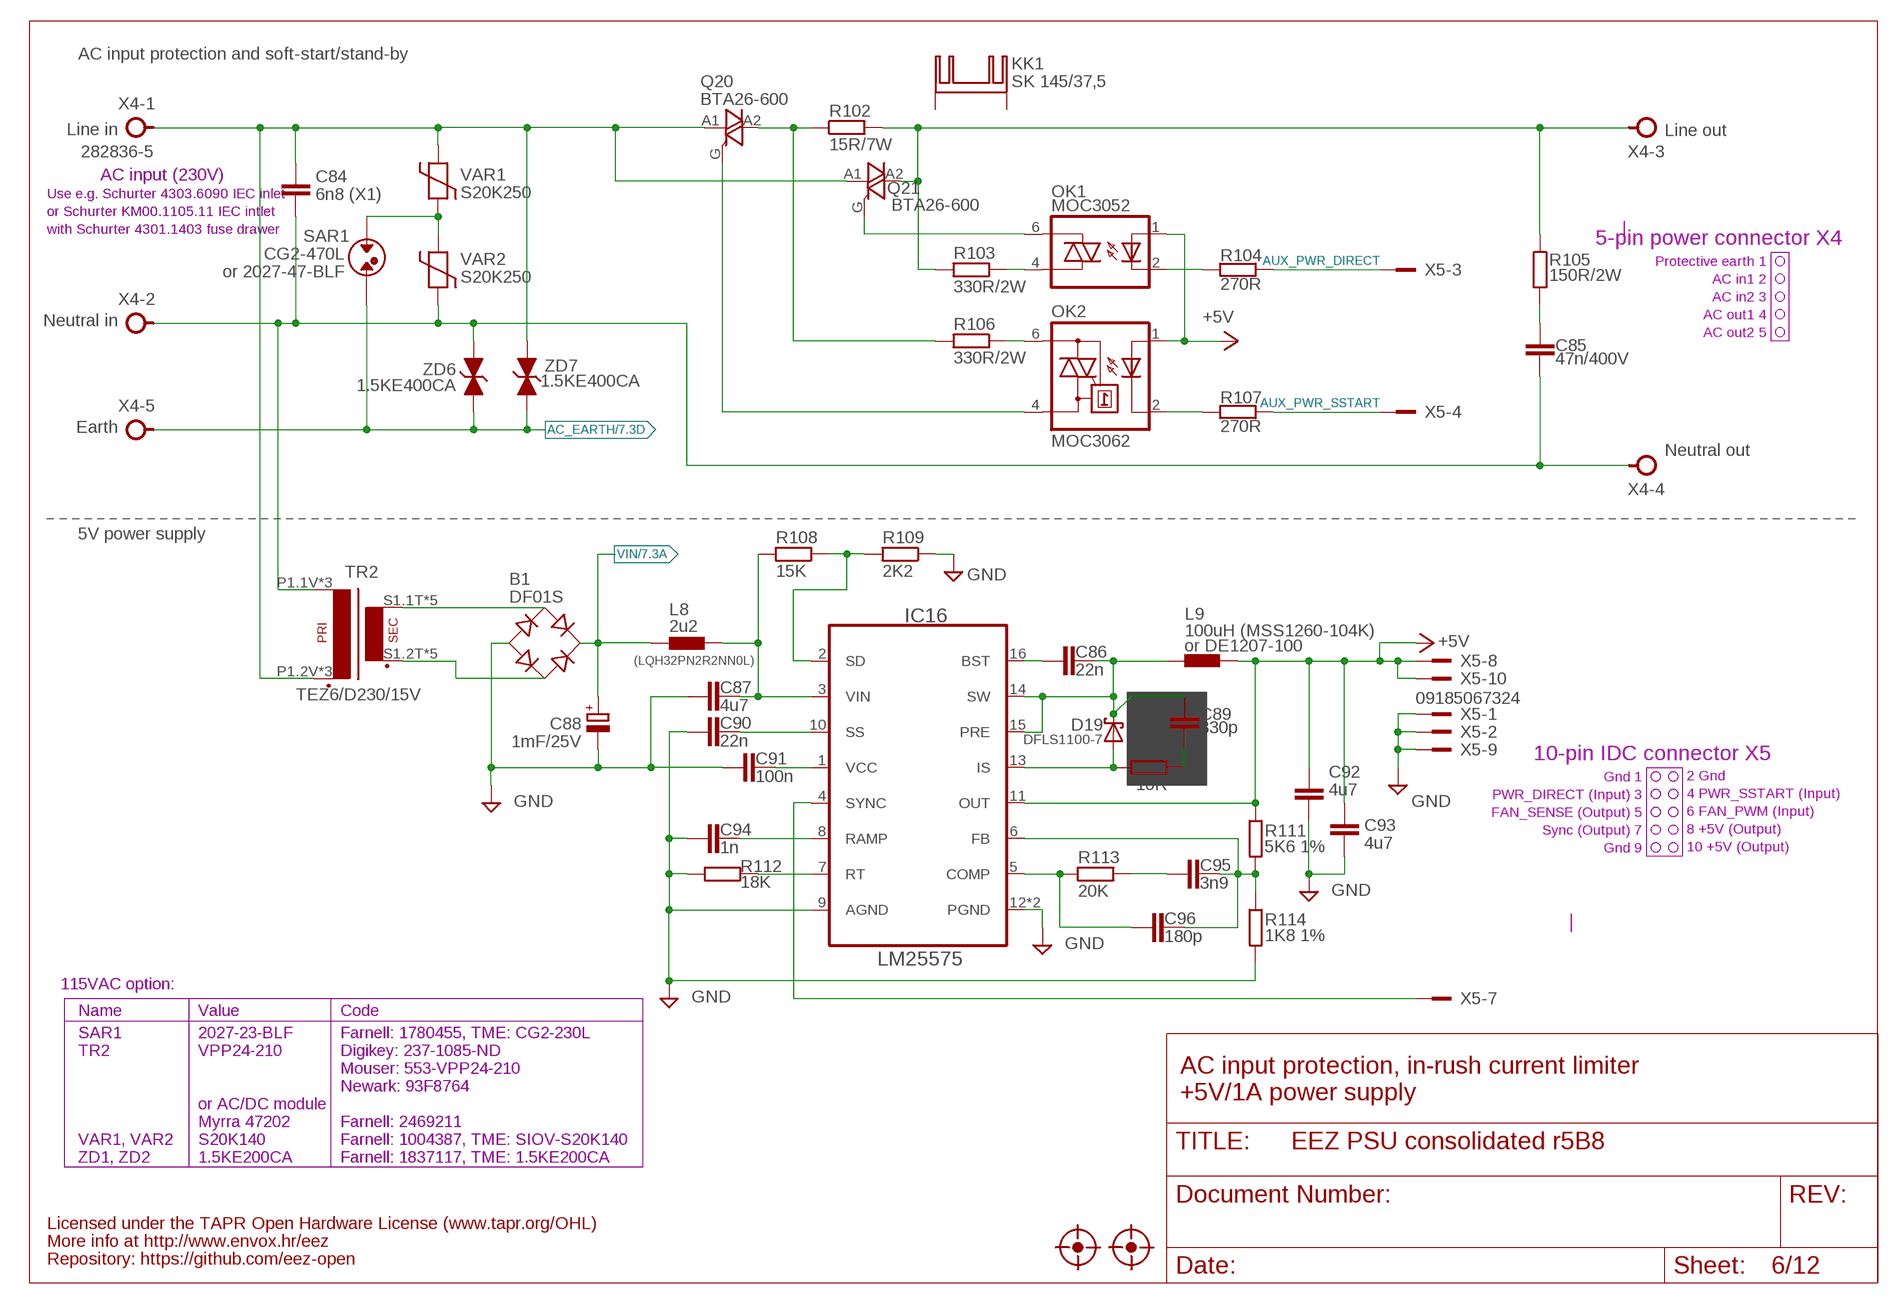
[diagram p5: schematic, sheet 6]

### Parts
B1  DF01S  [DFS]
C84  6n8 (X1)  C-EU102-064X133  [C102-064X133]
C85  47n/400V  C-EU075-052X106  [C075-052X106]
C86  22n  C-EUC0805  [C0805]
C87  4u7  C-EUC1210  [C1210]
C88  1mF/25V  ECAP5G_10.5MM  [ECAP5/10.5]
C89  330p  C-EUC0805  [C0805]
C90  22n  C-EUC0805  [C0805]
C91  100n  C-EUC0805  [C0805]
C92  4u7  C-EUC1210  [C1210]
C93  4u7  C-EUC1210  [C1210]
C94  1n  C-EUC0805  [C0805]
C95  3n9  C-EUC0805  [C0805]
C96  180p  C-EUC0805  [C0805]
D19  DFLS1100-7  SCHOTTKYSOD123  [SOD123]
IC16  LM25575  LM(2)5575  [SOP65P640X110-17N]
KK1  SK 145/37,5  SK145  [SK145]
L8  2u2  L1210  [L1210]
L9  100uH (MSS1260-104K)  COILCRAFT_MSS1278  [MSS1278]
OK1  MOC3052  MOC305X  [DIL6-SMD]
OK2  MOC3062  MOC3033S  [DIL6-SMD]
Q20  BTA26-600  BTA26-V  [TOP3S-1]
Q21  BTA26-600  BTA26-V  [TOP3S-1]
R102  15R/7W  R_EU7W  [R_0913]
R103  330R/2W  R-EU_R2512  [R2512]
R104  270R  R-EU_R0805  [R0805]
R105  150R/2W  R-EU_R2512  [R2512]
R106  330R/2W  R-EU_R2512  [R2512]
R107  270R  R-EU_R0805  [R0805]
R108  15K  R-EU_R0805  [R0805]
R109  2K2  R-EU_R0805  [R0805]
R110  10R  R-EU_R1206  [R1206]
R111  5K6 1%  R-EU_R0805  [R0805]
R112  18K  R-EU_R0805  [R0805]
R113  20K  R-EU_R0805  [R0805]
R114  1K8 1%  R-EU_R0805  [R0805]
SAR1  CG2-470L  SAR  [SAR]
TR2  TEZ6/D230/15V  PCB_TRAFO6VA_TEZ+VPP+MYRRA  [PCB_TRAFO6VA_7.5W]
U$13  FIDUCIAL_2  [FIDUCIAL_DUAL]
U$14  FIDUCIAL_2  [FIDUCIAL_DUAL]
VAR1  S20K250  VARISTOR  [VARISTOR]
VAR2  S20K250  VARISTOR  [VARISTOR]
X4  282836-5  TBLOCK5.0_5A  [TBLOCK5.0_5]
X5  09185067324  IDC-10PINBLACK  [IDC-10PIN]
ZD6  1.5KE400CA  1.5KE-BIDIR  [DO201-BIDIR]
ZD7  1.5KE400CA  1.5KE-BIDIR  [DO201-BIDIR]

### Nets
+5V: C92.1 C93.1 IC16.11(OUT) L9.2 OK1.1(A) OK2.1(A) R111.1 X5.8 X5.10 ; also sheet 2,3,4,5,7,8,9,10,11,12
AC_EARTH: SAR1.P$2 X4.5 ZD6.C ZD7.C ; also sheet 7
AC_IN1_MAIN: C84.1 Q20.A1 Q21.A1 TR2.P1.2V(P2) TR2.P2.2V(P2) TR2.P2_TEZ(P2) VAR1.P$2 X4.1 ZD7.A
AC_IN2_MAIN: C84.2 C85.1 TR2.P1.1V(P1) TR2.P1_TEZ(P1) TR2.P2.1V(P1) VAR2.P$1 X4.2 X4.4 ZD6.A
AUX_PWR_DIRECT: R104.2 X5.3
AUX_PWR_SSTART: R107.2 X5.4
DC_PREG2: C87.1 IC16.3(VIN) L8.2 R108.2
GND [gnd]: B1.- C87.2 C88.- C90.2 C91.1 C92.2 C93.2 C94.1 IC16.9(AGND) IC16.12(PGND) IC16.TP(PGND) R109.1 R112.2 R114.2 X5.1 X5.2 X5.9 ; also sheet 1,2,3,4,5,7,8,9,10,11,12
IS1: D19.A IC16.13(IS) R110.1
N$52: C95.2 R113.2
N$57: C95.1 C96.1 IC16.6(FB) R111.2 R114.1
N$58: C86.2 IC16.16(BST)
N$59: C96.2 IC16.5(COMP) R113.1
N$60: IC16.7(RT) R112.1
N$61: C91.2 IC16.1(VCC)
N$63: C94.2 IC16.8(RAMP)
N$66: C90.1 IC16.10(SS)
N$68: IC16.4(SYNC) X5.7
N$69: IC16.2(SD) R108.1 R109.2
N$70: C89.2 R110.2
N$71: OK1.6(A2) Q21.G
N$72: OK2.4(A1) Q20.G
N$73: OK2.6(A2) R106.1
N$74: OK1.2(C) R104.1
N$75: OK2.2(C) R107.1
N$76: OK1.4(A1) R103.1
N$78: B1.AC1 TR2.S1.1T(S1) TR2.S1.1V(S1) TR2.S2.1T(S1) TR2.S2.1V(S1) TR2.S2M(S1)
N$80: B1.AC2 TR2.S1.2T(S2) TR2.S1.2V(S2) TR2.S1M(S2) TR2.S2.2T(S2) TR2.S2.2V(S2)
N$81: Q20.A2 R102.1 R106.2
N$82: Q21.A2 R102.2 R103.2 R105.1 X4.3
N$83: C85.2 R105.2
N$114: SAR1.P$1 VAR1.P$1 VAR2.P$2
SW2: C86.1 C89.1 D19.C IC16.14(SW) IC16.15(PRE) L9.1
VIN: B1.+ C88.+ L8.1 ; also sheet 7
Unconnected: KK1.1(K) KK1.2(K)

### Notes on the sheet
- AC input protection and soft-start/stand-by
- Line in
- Line out
- AC input (230V)
- Use e.g. Schurter 4303.6090 IEC inlet
- or Schurter KM00.1105.11 IEC intlet
- 5-pin power connector X4
- with Schurter 4301.1403 fuse drawer
- Protective earth 1
- or 2027-47-BLF
- AC in1 2
- AC in2 3
- AC out1 4
- Neutral in
- AC out2 5
- Earth
- Neutral out
- 5V power supply
- or DE1207-100
- (LQH32PN2R2NN0L)
- 10-pin IDC connector X5
- Gnd 1
- 2 Gnd
- PWR_DIRECT (Input) 3
- 4 PWR_SSTART (Input)
- FAN_SENSE (Output) 5
- 6 FAN_PWM (Input)
- Sync (Output) 7
- 8 +5V (Output)
- Gnd 9
- 10 +5V (Output)
- 115VAC option:
- Name | Value | Code
- SAR1 | 2027-23-BLF | Farnell: 1780455, TME: CG2-230L
- TR2 | VPP24-210 | Digikey: 237-1085-ND
- Mouser: 553-VPP24-210 | AC input protection, in-rush current limiter
- Newark: 93F8764
- +5V/1A power supply
- or AC/DC module
- Myrra 47202 | Farnell: 2469211
- VAR1, VAR2 | S20K140 | Farnell: 1004387, TME: SIOV-S20K140
- ZD1, ZD2 | 1.5KE200CA | Farnell: 1837117, TME: 1.5KE200CA
- Licensed under the TAPR Open Hardware License (www.tapr.org/OHL)
- More info at http://www.envox.hr/eez
- Repository: https://github.com/eez-open

## Sheet 7 of 12
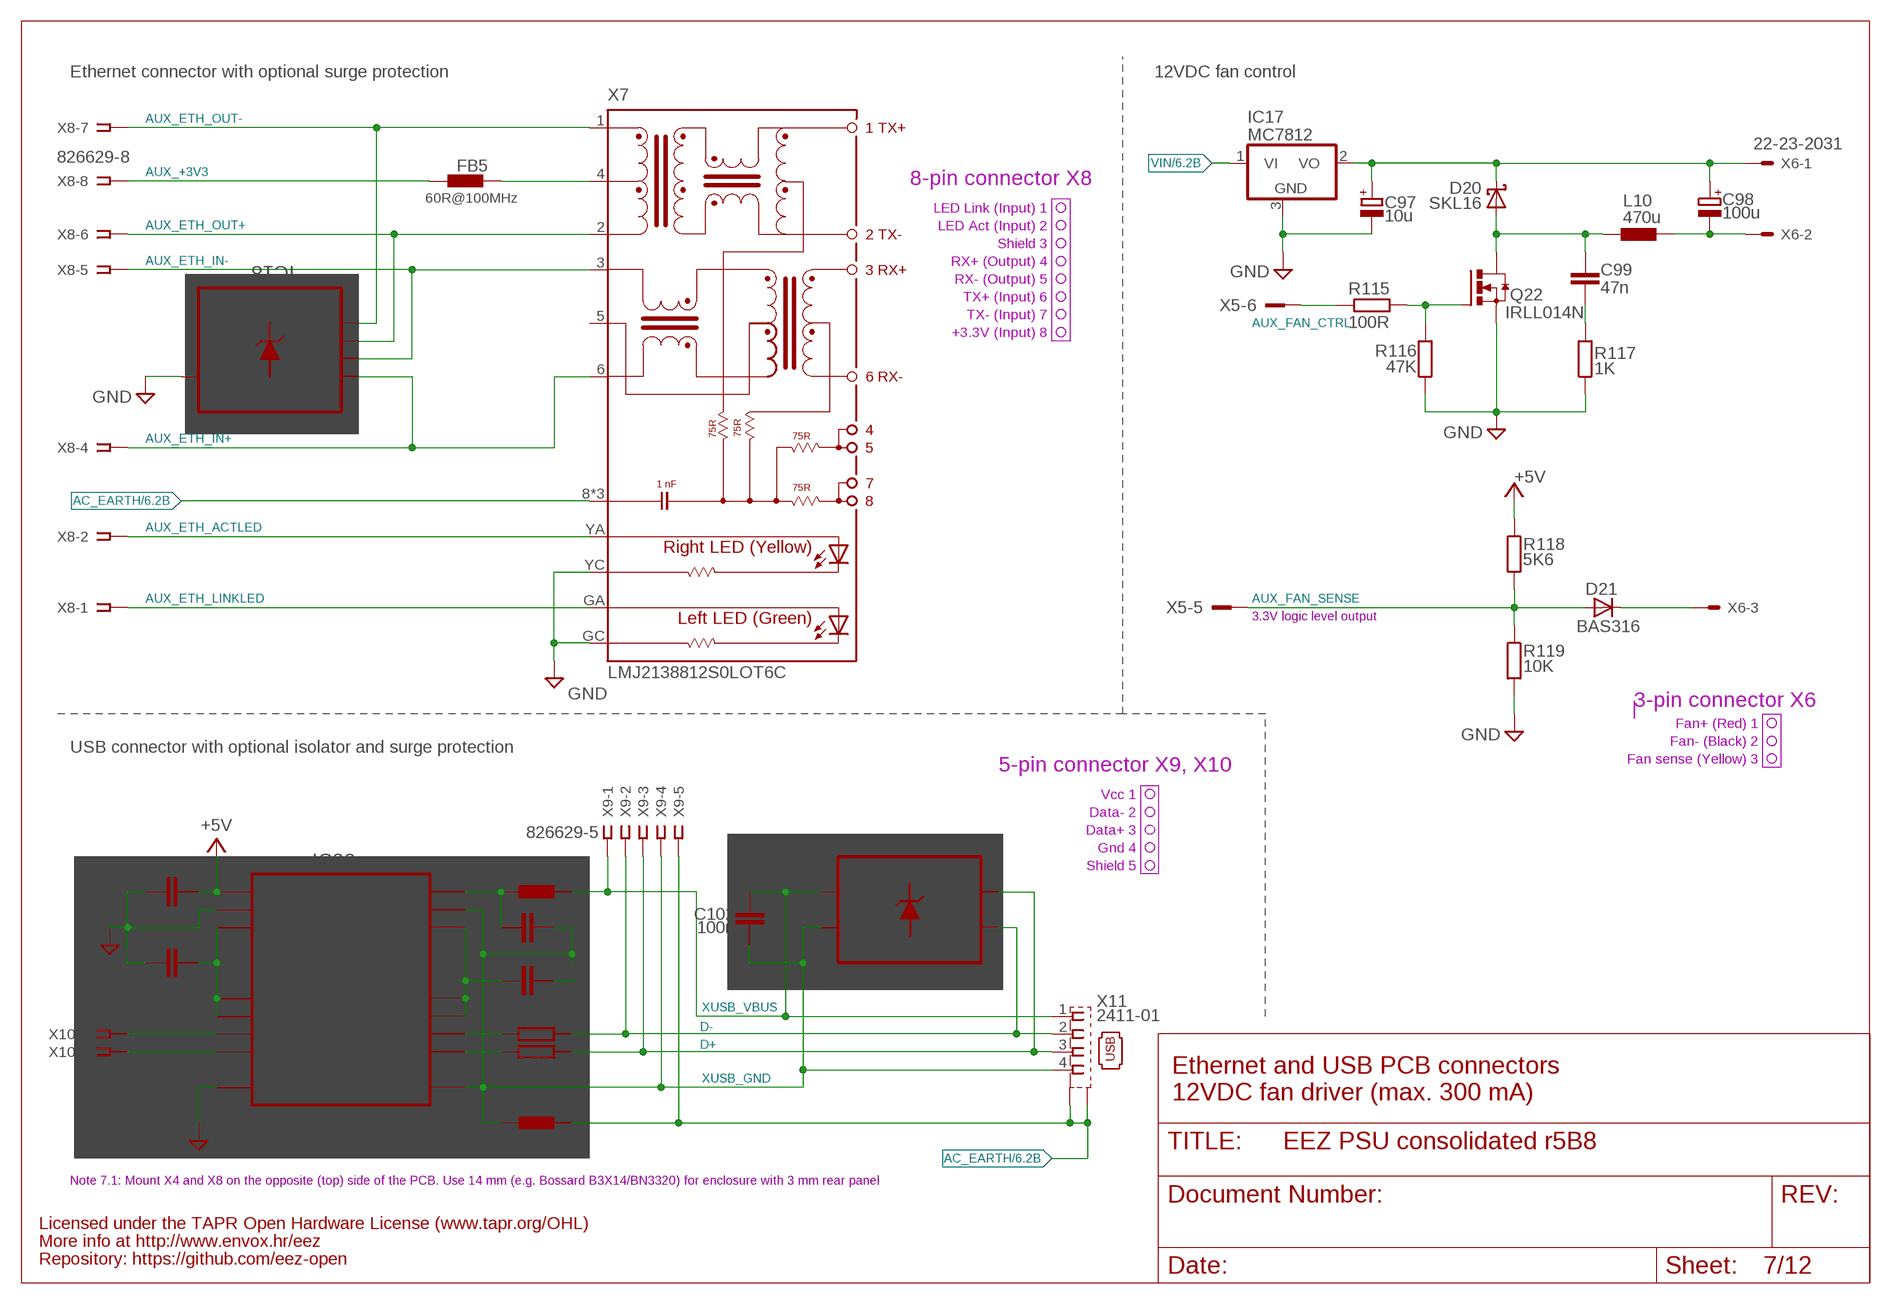
[diagram p6: schematic, sheet 7]

### Parts
C97  10u  ECAPPANASONIC_C  [PANASONIC_C]
C98  100u  ECAPPANASONIC_H  [CAPAE660X610N]
C99  47n  C-EUC0805  [C0805]
C100  100n  C-EUC0603  [C0603]
C101  100n  C-EUC0603  [C0603]
C102  100n  C-EUC0603  [C0603]
C103  100n  C-EUC0603  [C0603]
C104  100n  C-EUC0603  [C0603]
D20  SKL16  SCHOTTKYSOD123  [SOD123]
D21  BAS316  DIODE-SOD323-W  [SOD323-W]
FB5  60R@100MHz  FERRITE_BEAD0603  [BEAD0603]
FB6  60R@100MHz  FERRITE_BEAD0603  [BEAD0603]
FB7  60R@100MHz  FERRITE_BEAD0603  [BEAD0603]
IC17  MC7812  MC78XX  [TO252]
IC18  TPD4E002DRLR  [SOT50P280X60-5N]
IC19  TPD2E001DZDR  [SOP192P292X122-4N]
IC20  ADUM3160BRWZ  ADUM3160BRWZWIDE  [SOIC-16W]
L10  470u  DE0704  [DE0704]
Q22  IRLL014N  N-HEXFET-2D_SOT232-IRLL014N  [SOT223]
R115  100R  R-EU_R0805  [R0805]
R116  47K  R-EU_R0805  [R0805]
R117  1K  R-EU_R0805  [R0805]
R118  5K6  R-EU_R0805  [R0805]
R119  10K  R-EU_R0805  [R0805]
R120  22R  R-EU_R0805  [R0805]
R121  22R  R-EU_R0805  [R0805]
X6  22-23-2031  [22-23-2031]
X7  LMJ2138812S0LOT6C  RJ45-VERT  [RJ45-VERT]
X8  826629-8  SSW-108-02-S-S  [SSW-108-02-S-S]
X9  826629-5  SSW-105-02-S-S  [SSW-105-02-S-S]
X10  826629-5  SSW-105-02-S-S  [SSW-105-02-S-S]
X11  2411-01  KUSBVX-BS1N  [KUSBVX-BS1N]

### Nets
12VDC: C97.1(+) C98.1(+) D20.C IC17.2(VO) X6.1
+5V: C100.1 IC20.16(VBUS2) R118.1 ; also sheet 2,3,4,5,6,8,9,10,11,12
AC_EARTH: FB7.P$1 X7.8(SH) X7.SH1(SH) X7.SH2(SH) X9.5 X11.M1(S1) X11.M2(S2) ; also sheet 6
AUX_+3V3: FB5.P$2 X8.8
AUX_ETH_ACTLED: X7.YA(YELLOW_A) X8.2
AUX_ETH_IN+: IC18.5(IO4) X7.6(RD-) X8.4
AUX_ETH_IN-: IC18.4(IO3) X7.3(RD+) X8.5
AUX_ETH_LINKLED: X7.GA(GREEN-A) X8.1
AUX_ETH_OUT+: IC18.3(IO2) X7.2(TD-) X8.6
AUX_ETH_OUT-: IC18.1(IO1) X7.1(TD+) X8.7
AUX_FAN_CTRL: R115.2 X5.6
AUX_FAN_SENSE: D21.A R118.2 R119.1 X5.5
D+: IC19.2(IO1) R121.1 X9.3 X11.3
D-: IC19.3(IO2) R120.1 X9.2 X11.2
FAN_OUT: C99.2 D20.A L10.2 Q22.2(D) Q22.4(D)
GND [gnd]: C97.2(-) C100.2 C103.2 IC17.3(GND) IC18.2(GND) IC20.9(GND2) IC20.15(GND2_2) Q22.3(S) R116.1 R117.1 R119.2 X7.GC(GREEN-C) X7.YC(YELLOW-C) ; supply symbol labelled PGND ; also sheet 1,2,3,4,5,6,8,9,10,11,12
MCU_D+: IC20.10(DD+) X10.3
MCU_D-: IC20.11(DD-) X10.2
N$84: C99.1 R117.2
N$85: Q22.1(G) R115.1 R116.2
N$86: C98.2(-) L10.1 X6.2
N$87: C104.1 IC20.3(VDD1) IC20.4(PDEN) IC20.5(SPU)
N$88: IC20.6(UD-) R120.2
N$89: IC20.7(UD+) R121.2
N$90: C101.1 FB6.P$2 IC20.1(VBUS1)
N$91: C103.1 IC20.12(PIN) IC20.13(SPD) IC20.14(VDD2)
N$125: FB5.P$1 X7.4(CT)
N$163: D21.C X6.3
VIN: IC17.1(VI) ; also sheet 6
XUSB_GND: C101.2 C102.1 C104.2 FB7.P$2 IC19.1(GND) IC20.2(GND1_2) IC20.8(GND1) X9.4 X11.4
XUSB_VBUS: C102.2 FB6.P$1 IC19.4(VCC) X9.1 X11.1
Unconnected: X7.5(CR) X8.3 X10.1 X10.4 X10.5

### Notes on the sheet
- Ethernet connector with optional surge protection | 12VDC fan control
- 8-pin connector X8
- LED Link (Input) 1
- LED Act (Input) 2
- Shield 3
- RX+ (Output) 4
- RX- (Output) 5
- TX+ (Input) 6
- TX- (Input) 7
- +3.3V (Input) 8
- 3.3V logic level output
- 3-pin connector X6
- Fan+ (Red) 1
- Fan- (Black) 2
- USB connector with optional isolator and surge protection
- Fan sense (Yellow) 3
- 5-pin connector X9, X10
- Vcc 1
- Data- 2
- Data+ 3
- Gnd 4
- Shield 5
- Ethernet and USB PCB connectors
- 12VDC fan driver (max. 300 mA)
- Note 7.1: Mount X4 and X8 on the opposite (top) side of the PCB. Use 14 mm (e.g. Bossard B3X14/BN3320) for enclosure with 3 mm rear panel
- Licensed under the TAPR Open Hardware License (www.tapr.org/OHL)
- More info at http://www.envox.hr/eez
- Repository: https://github.com/eez-open

## Sheet 8 of 12
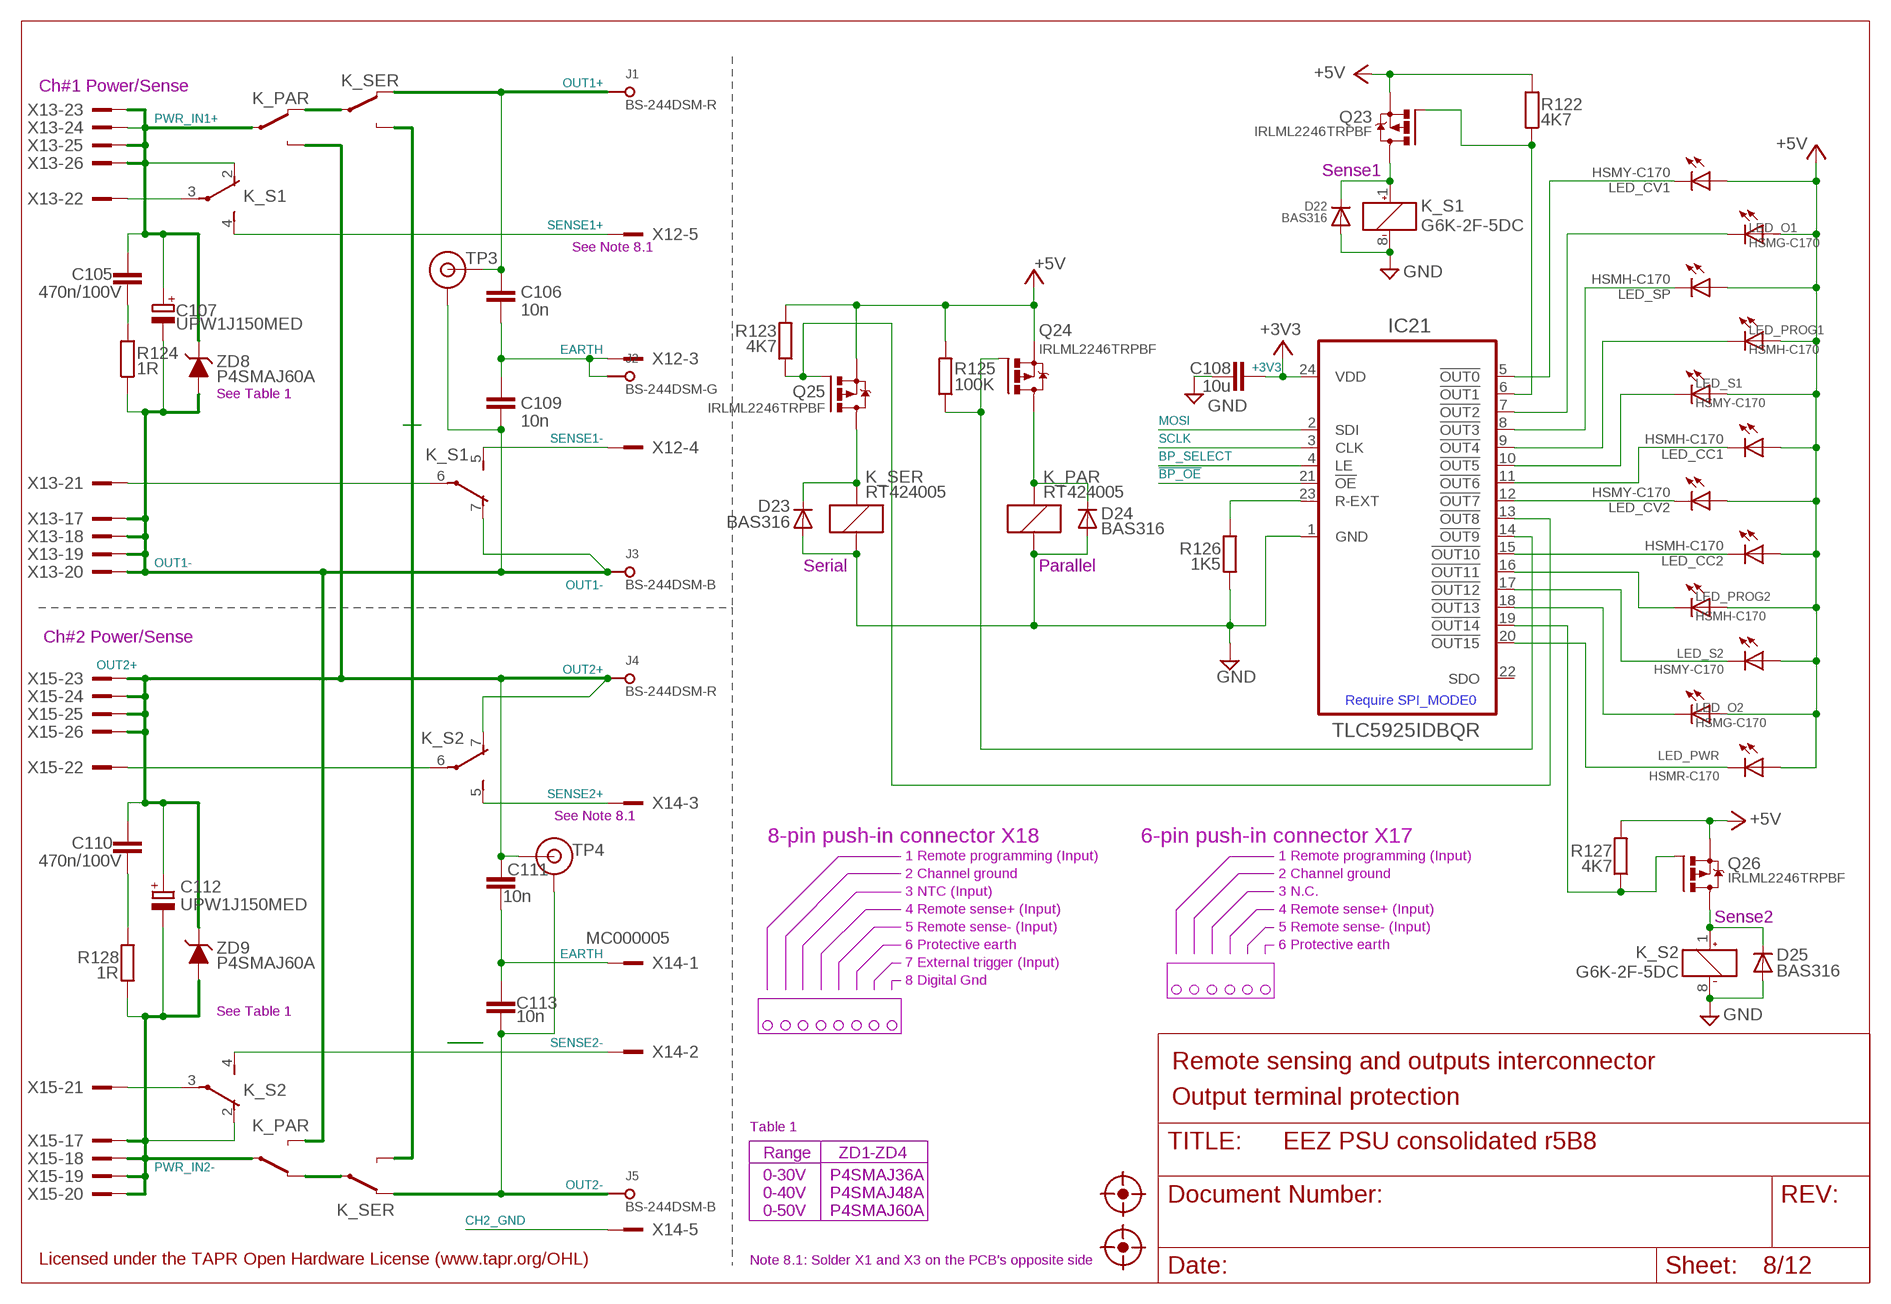
[diagram p7: schematic, sheet 8]

### Parts
C105  470n/100V  C-EUC1812  [C1812]
C106  10n  C-EUC1206  [C1206]
C107  UPW1J150MED  ECAPEEEFK+2.5MM  [CAPAE660X610N_COMBO2]
C108  10u  C-EUC1206  [C1206]
C109  10n  C-EUC1206  [C1206]
C110  470n/100V  C-EUC1812  [C1812]
C111  10n  C-EUC1206  [C1206]
C112  UPW1J150MED  ECAPEEEFK+2.5MM  [CAPAE660X610N_COMBO2]
C113  10n  C-EUC1206  [C1206]
D22  BAS316  DIODE-SOD323-W  [SOD323-W]
D23  BAS316  DIODE-SOD323-W  [SOD323-W]
D24  BAS316  DIODE-SOD323-W  [SOD323-W]
D25  BAS316  DIODE-SOD323-W  [SOD323-W]
IC21  TLC5925IDBQR  [SOP63P600X175-24N]
J1  BS-244DSM-R  BINDING_POST-2  [BP_5_12]
J2  BS-244DSM-G  BINDING_POST-2  [BP_5_12]
J3  BS-244DSM-B  BINDING_POST-2  [BP_5_12]
J4  BS-244DSM-R  BINDING_POST-2  [BP_5_12]
J5  BS-244DSM-B  BINDING_POST-2  [BP_5_12]
K_PAR  RT424005  RELAY_RT314012-2  [RT-C/016A5_ROUND]
K_S1  G6K-2F-5DC  G6K-2F  [G6K-2F]
K_S2  G6K-2F-5DC  G6K-2F  [G6K-2F]
K_SER  RT424005  RELAY_RT314012-2  [RT-C/016A5_ROUND]
LED_CC1  HSMH-C170  LED0805  [LED_0805]
LED_CC2  HSMH-C170  LED0805  [LED_0805]
LED_CV1  HSMY-C170  LED0805  [LED_0805]
LED_CV2  HSMY-C170  LED0805  [LED_0805]
LED_O1  HSMG-C170  LED0805  [LED_0805]
LED_O2  HSMG-C170  LED0805  [LED_0805]
LED_PROG1  HSMH-C170  LED0805  [LED_0805]
LED_PROG2  HSMH-C170  LED0805  [LED_0805]
LED_PWR  HSMR-C170  LED0805  [LED_0805]
LED_S1  HSMY-C170  LED0805  [LED_0805]
LED_S2  HSMY-C170  LED0805  [LED_0805]
LED_SP  HSMH-C170  LED0805  [LED_0805]
Q23  IRLML2246TRPBF  [SOT95P237X112-3N]
Q24  IRLML2246TRPBF  [SOT95P237X112-3N]
Q25  IRLML2246TRPBF  [SOT95P237X112-3N]
Q26  IRLML2246TRPBF  [SOT95P237X112-3N]
R122  4K7  R-EU_R0805  [R0805]
R123  4K7  R-EU_R0805  [R0805]
R124  1R  R-EU_R0805  [R0805]
R125  100K  R-EU_R0805  [R0805]
R126  1K5  R-EU_R0805  [R0805]
R127  4K7  R-EU_R0805  [R0805]
R128  1R  R-EU_R0805  [R0805]
TP3  TEST_POINT  [TP_1.1MM]
TP4  TEST_POINT  [TP_1.1MM]
U$15  FIDUCIAL_2  [FIDUCIAL_DUAL]
U$16  FIDUCIAL_2  [FIDUCIAL_DUAL]
X12  MC000006  MC000006MIRROR  [MC000006_MIRROR]
X13  TSW-113-07-F-D  [TSW-113-07-F-D]
X14  MC000005  MC000005MIRROR  [MC000005_MIRROR]
X15  TSW-113-07-F-D  [TSW-113-07-F-D]
ZD8  P4SMAJ60A  PSMAXX  [DO214AC]
ZD9  P4SMAJ60A  PSMAXX  [DO214AC]

### Nets
!BP_OE: IC21.21(!OE) ; also sheet 9
!BP_OUT0: IC21.5(!OUT0) LED_CV1.C
!BP_OUT1: IC21.6(!OUT1) Q23.1(G) R122.1
!BP_OUT2: IC21.7(!OUT2) LED_O1.C
!BP_OUT3: IC21.8(!OUT3) LED_SP.C
!BP_OUT4: IC21.9(!OUT4) LED_PROG1.C
!BP_OUT5: IC21.10(!OUT5) LED_S1.C
!BP_OUT6: IC21.11(!OUT6) LED_CC1.C
!BP_OUT7: IC21.12(!OUT7) LED_CV2.C
!BP_OUT8: IC21.13(!OUT8) Q25.1(G) R123.1
!BP_OUT9: IC21.14(!OUT9) Q24.1(G) R125.1
!BP_OUT10: IC21.15(!OUT10) LED_CC2.C
!BP_OUT12: IC21.17(!OUT12) LED_S2.C
!BP_OUT13: IC21.18(!OUT13) LED_O2.C
!BP_OUT14: IC21.19(!OUT14) Q26.1(G) R127.1
!BP_OUT15: IC21.20(!OUT15) LED_PWR.C
+3V3: C108.1 IC21.24(VDD) ; also sheet 9,10,11,12
+5V: LED_CC1.A LED_CC2.A LED_CV1.A LED_CV2.A LED_O1.A LED_O2.A LED_PROG1.A LED_PROG2.A LED_PWR.A LED_S1.A LED_S2.A LED_SP.A Q23.2(S) Q24.2(S) Q25.2(S) Q26.2(S) R122.2 R123.2 R125.2 R127.2 ; also sheet 2,3,4,5,6,7,9,10,11,12
BP_SELECT: IC21.4(LE) ; also sheet 9
CH2_GND: X14.5 X14.5.1 ; also sheet 9,11
EARTH: C106.2 C109.1 C111.2 C113.1 J2.P$1 X12.3 X12.3.1 X14.1 X14.1.1 ; also sheet 1,10
GND [gnd]: C108.2 D22.A D23.A D24.A D25.A IC21.1(GND) K_PAR.A1(K:C2) K_S1.8(1:-) K_S2.8(1:-) K_SER.A1(K:C2) R126.1 ; also sheet 1,2,3,4,5,6,7,9,10,11,12
MOSI: IC21.2(SDI) ; also sheet 9,10,12
N$92: D22.C K_S1.1(1:+) Q23.3(D)
N$93: D25.C K_S2.1(1:+) Q26.3(D)
N$94: C105.2 R124.2
N$95: C110.2 R128.2
N$96: IC21.16(!OUT11) LED_PROG2.C
N$97: K_SER.14A(-1:O) K_SER.14B(-2:O)
N$98: K_PAR.12A(-1:S) K_SER.11B(-2:P)
N$99: K_PAR.12B(-2:S) K_SER.11A(-1:P)
N$155: D23.C K_SER.A2(K:C1) Q25.3(D)
N$156: D24.C K_PAR.A2(K:C1) Q24.3(D)
N$306: IC21.23(R-EXT) R126.2
OUT1+: C106.1 J1.P$1 K_SER.12B(-2:S) TP3.TIP
OUT1-: C107.2(-) C107.2.1(-) C109.2 J3.P$1 K_PAR.14B(-2:O) K_S1.7(3:O) R124.1 TP3.GND X13.17 X13.18 X13.19 X13.20 ZD8.A
OUT2+: C110.1 C111.1 C112.1(+) C112.1.1(+) J4.P$1 K_PAR.14A(-1:O) K_S2.7(3:O) TP4.TIP X15.23 X15.24 X15.25 X15.26 ZD9.C
OUT2-: C113.2 J5.P$1 K_SER.12A(-1:S) TP4.GND
PWR_IN1+: C105.1 C107.1(+) C107.1.1(+) K_PAR.11A(-1:P) K_S1.2(2:O) X13.23 X13.24 X13.25 X13.26 ZD8.C
PWR_IN2-: C112.2(-) C112.2.1(-) K_PAR.11B(-2:P) K_S2.2(2:O) R128.1 X15.17 X15.18 X15.19 X15.20 ZD9.A
SCLK: IC21.3(CLK) ; also sheet 9,10,12
SENSE1+: K_S1.4(2:S) X12.5 X12.5.1
SENSE1-: K_S1.5(3:S) X12.4 X12.4.1
SENSE1_IN+: K_S1.3(2:P) X13.22
SENSE1_IN-: K_S1.6(3:P) X13.21
SENSE2+: K_S2.5(3:S) X14.3 X14.3.1
SENSE2-: K_S2.4(2:S) X14.2 X14.2.1
SENSE2_IN+: K_S2.6(3:P) X15.22
SENSE2_IN-: K_S2.3(2:P) X15.21
Unconnected: IC21.22(SDO) X14.4 X14.4.1

### Notes on the sheet
- Ch#1 Power/Sense
- Sense1
- See Note 8.1
- See Table 1
- Serial | Parallel
- Ch#2 Power/Sense
- Require SPI_MODE0
- See Note 8.1
- 8-pin push-in connector X18 | 6-pin push-in connector X17
- 1 Remote programming (Input) | 1 Remote programming (Input)
- 2 Channel ground | 2 Channel ground
- 3 NTC (Input) | 3 N.C.
- 4 Remote sense+ (Input) | 4 Remote sense+ (Input)
- Sense2
- 5 Remote sense- (Input) | 5 Remote sense- (Input)
- 6 Protective earth | 6 Protective earth
- 7 External trigger (Input)
- 8 Digital Gnd
- See Table 1
- Remote sensing and outputs interconnector
- Output terminal protection
- Table 1
- Range | ZD1-ZD4
- 0-30V | P4SMAJ36A
- 0-40V | P4SMAJ48A
- 0-50V | P4SMAJ60A
- Licensed under the TAPR Open Hardware License (www.tapr.org/OHL) | Note 8.1: Solder X1 and X3 on the PCB's opposite side

## Sheet 9 of 12
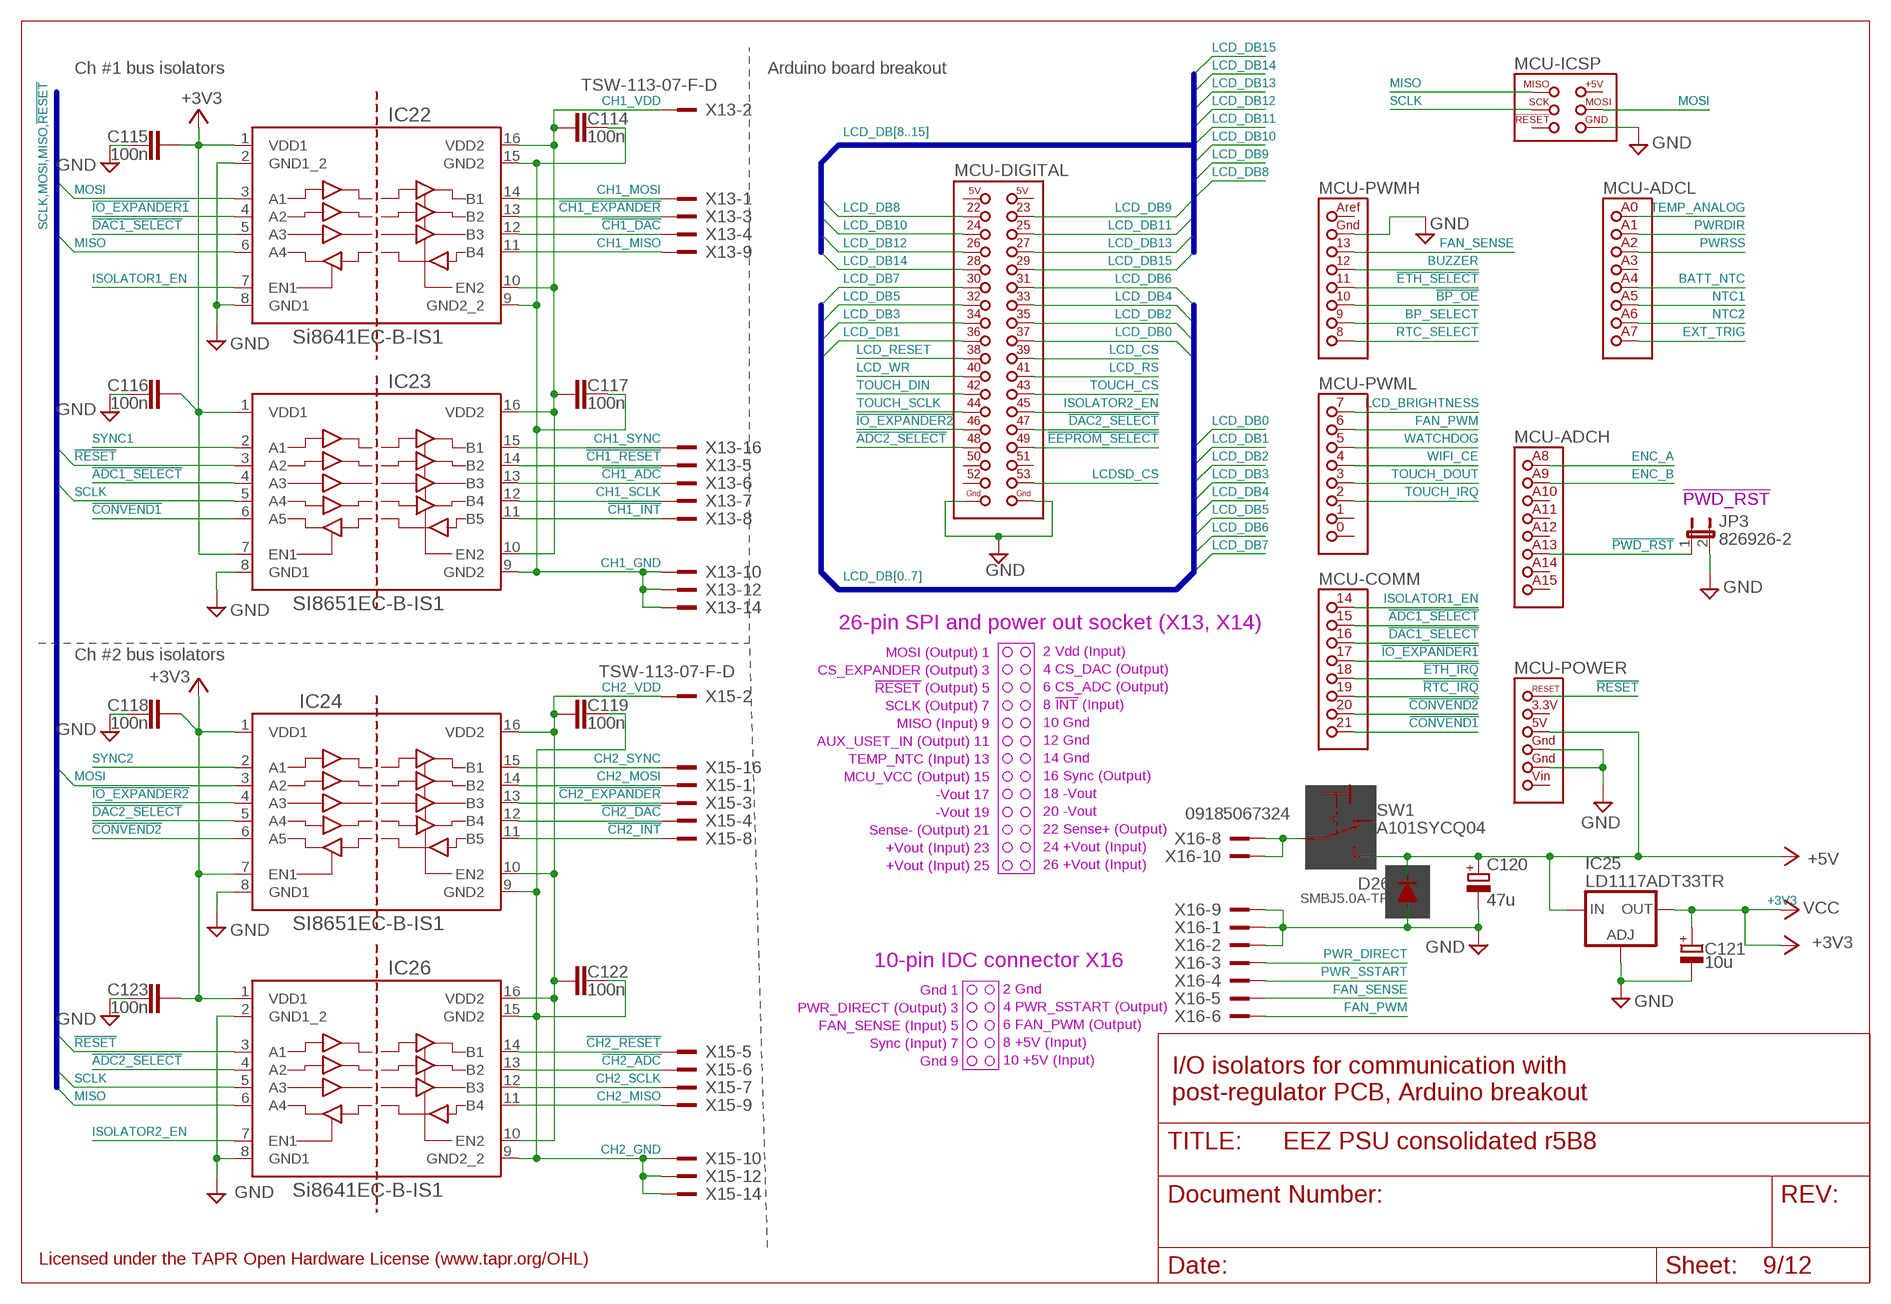
[diagram p8: schematic, sheet 9]

### Parts
C114  100n  C-EUC0603  [C0603]
C115  100n  C-EUC0603  [C0603]
C116  100n  C-EUC0603  [C0603]
C117  100n  C-EUC0603  [C0603]
C118  100n  C-EUC0603  [C0603]
C119  100n  C-EUC0603  [C0603]
C120  47u  ECAPPANASONIC_C  [PANASONIC_C]
C121  10u  ECAPPANASONIC_C  [PANASONIC_C]
C122  100n  C-EUC0603  [C0603]
C123  100n  C-EUC0603  [C0603]
D26  SMBJ5.0A-TR  DIODEDO214AA  [DO214AA]
IC22  Si8641EC-B-IS1  SI8641NSOIC-16  [SOIC-16]
IC23  SI8651EC-B-IS1  SI8651NSOIC-16  [SOIC-16]
IC24  SI8651EC-B-IS1  SI8651NSOIC-16  [SOIC-16]
IC25  LD1117ADT33TR  LD117ADT33TR  [DPACK]
IC26  Si8641EC-B-IS1  SI8641NSOIC-16  [SOIC-16]
JP3  826926-2  JP1E  [JP1]
MCU  Arduino Due  ARDUINO_MEGA+ICSPMIRROR  [ARDUINO+ICSP_MIRROR]
SW1  A101SYCQ04  M9040P  [M9040P]
X16  09185067324  IDC-10PINBLACK  [IDC-10PIN]

### Nets
!ADC1_SELECT: IC23.4(A3) MCU.15
!ADC2_SELECT: IC26.4(A2) MCU.48(-DIGITAL:48(PL3))
!BP_OE: MCU.10 ; also sheet 8
!CH1_ADC: IC23.13(B3) X13.6
!CH1_DAC: IC22.12(B3) X13.4
!CH1_EXPANDER: IC22.13(B2) X13.3
!CH1_INT: IC23.11(B5) X13.8
!CH1_RESET: IC23.14(B2) X13.5
!CH2_ADC: IC26.13(B2) X15.6
!CH2_DAC: IC24.12(B4) X15.4
!CH2_EXPANDER: IC24.13(B3) X15.3
!CH2_INT: IC24.11(B5) X15.8
!CH2_RESET: IC26.14(B1) X15.5
!CONVEND1: IC23.6(A5) MCU.21
!CONVEND2: IC24.6(A5) MCU.20
!DAC1_SELECT: IC22.5(A3) MCU.16
!DAC2_SELECT: IC24.5(A4) MCU.47(-DIGITAL:47(PL4))
!EEPROM_SELECT: MCU.49(-DIGITAL:49(PL2)) ; also sheet 10
!ETH_IRQ: MCU.18 ; also sheet 10,12
!ETH_SELECT: MCU.11 ; also sheet 10,12
!IO_EXPANDER1: IC22.4(A2) MCU.17
!IO_EXPANDER2: IC24.4(A3) MCU.46(-DIGITAL:46(PL5))
!PWD_RST: JP3.1 MCU.A13(-ADCH:ADC13)
!RESET: IC23.3(A2) IC26.3(A1) MCU.RESET(-POWER:!RESET) ; also sheet 10,11,12
!RTC_IRQ: MCU.19 ; also sheet 10
+3V3: C115.1 C116.1 C118.1 C121.1(+) C123.1 IC22.1(VDD1) IC23.1(VDD1) IC23.7(EN1) IC24.1(VDD1) IC24.7(EN1) IC25.4(OUT) IC26.1(VDD1) ; supply symbol labelled VCC ; also sheet 8,10,11,12
+5V: C120.1(+) D26.C IC25.3(IN) MCU.5V(-POWER:5V) SW1.3(S) ; also sheet 2,3,4,5,6,7,8,10,11,12
BATT_NTC: MCU.A4(-ADCL:ADC4) ; also sheet 11
BP_SELECT: MCU.9(-PWMH:9(PH6)) ; also sheet 8
BUZZER: MCU.12 ; also sheet 10
CH1_GND: C114.2 C117.2 IC22.9(GND2_2) IC22.15(GND2) IC23.9(GND2) X13.10 X13.12 X13.14 ; also sheet 11
CH1_MISO: IC22.11(B4) X13.9
CH1_MOSI: IC22.14(B1) X13.1
CH1_SCLK: IC23.12(B4) X13.7
CH1_SYNC: IC23.15(B1) X13.16
CH1_VDD: C114.1 C117.1 IC22.10(EN2) IC22.16(VDD2) IC23.10(EN2) IC23.16(VDD2) X13.2 ; also sheet 11
CH2_GND: C119.2 C122.2 IC24.9(GND2) IC26.9(GND2_2) IC26.15(GND2) X15.10 X15.12 X15.14 ; also sheet 8,11
CH2_MISO: IC26.11(B4) X15.9
CH2_MOSI: IC24.14(B2) X15.1
CH2_SCLK: IC26.12(B3) X15.7
CH2_SYNC: IC24.15(B1) X15.16
CH2_VDD: C119.1 C122.1 IC24.10(EN2) IC24.16(VDD2) IC26.10(EN2) IC26.16(VDD2) X15.2
ENC_A: MCU.A8(-ADCH:ADC8) ; also sheet 12
ENC_B: MCU.A9(-ADCH:ADC9) ; also sheet 12
EXT_TRIG: MCU.A7(-ADCL:ADC7) ; also sheet 11
FAN_PWM: MCU.6(-PWML:6(PH3)) X16.6
FAN_SENSE: MCU.13 X16.5
GND [gnd]: C115.2 C116.2 C118.2 C120.2(-) C121.2(-) C123.2 D26.A IC22.2(GND1_2) IC22.8(GND1) IC23.8(GND1) IC24.8(GND1) IC25.1(ADJ) IC26.2(GND1_2) IC26.8(GND1) JP3.2 MCU.GND1(-POWER:GND1) MCU.GND2(-POWER:GND2) MCU.GND3(-DIGITAL:GND3) MCU.GND4(-DIGITAL:GND4) MCU.GND(-PWMH:GND) MCU.ICSP_GND(-ICSP:GND) X16.1 X16.2 X16.9 ; also sheet 1,2,3,4,5,6,7,8,10,11,12
ISOLATOR1_EN: IC22.7(EN1) MCU.14
ISOLATOR2_EN: IC26.7(EN1) MCU.45(-DIGITAL:45(PL6))
LCD_BRIGHTNESS: MCU.7(-PWML:7(PH4)) ; also sheet 10
LCD_CS: MCU.39(-DIGITAL:39(PC0)) ; also sheet 10
LCD_DB0: MCU.37(-DIGITAL:37(PC2)) ; also sheet 10
LCD_DB1: MCU.36(-DIGITAL:36(PC3)) ; also sheet 10
LCD_DB2: MCU.35(-DIGITAL:35(PC4)) ; also sheet 10
LCD_DB3: MCU.34(-DIGITAL:34(PC5)) ; also sheet 10
LCD_DB4: MCU.33(-DIGITAL:33(PC6)) ; also sheet 10
LCD_DB5: MCU.32(-DIGITAL:32(PC7)) ; also sheet 10
LCD_DB6: MCU.31(-DIGITAL:31(PA7)) ; also sheet 10
LCD_DB7: MCU.30(-DIGITAL:30(PA6)) ; also sheet 10
LCD_DB8: MCU.22 ; also sheet 10
LCD_DB9: MCU.23 ; also sheet 10
LCD_DB10: MCU.24(-DIGITAL:24(PA0)) ; also sheet 10
LCD_DB11: MCU.25(-DIGITAL:25(PA1)) ; also sheet 10
LCD_DB12: MCU.26(-DIGITAL:26(PA2)) ; also sheet 10
LCD_DB13: MCU.27(-DIGITAL:27(PA3)) ; also sheet 10
LCD_DB14: MCU.28(-DIGITAL:28(PA4)) ; also sheet 10
LCD_DB15: MCU.29(-DIGITAL:29(PA5)) ; also sheet 10
LCD_RESET: MCU.38(-DIGITAL:38(PC1)) ; also sheet 10
LCD_RS: MCU.41(-DIGITAL:41(PG2)) ; also sheet 10
LCD_WR: MCU.40(-DIGITAL:40(PD7)) ; also sheet 10
LCDSD_CS: MCU.53(-DIGITAL:53(PB2/MOSI)) ; also sheet 10
MISO: IC22.6(A4) IC26.6(A4) MCU.ICSP_MISO(-ICSP:MISO) ; also sheet 10,12
MOSI: IC22.3(A1) IC24.3(A2) MCU.ICSP_MOSI(-ICSP:MOSI) ; also sheet 8,10,12
N$100: SW1.2(P) X16.8 X16.10
NTC1: MCU.A5(-ADCL:ADC5) ; also sheet 10
NTC2: MCU.A6(-ADCL:ADC6) ; also sheet 10
PWR_DIRECT: X16.3 ; also sheet 11
PWR_SSTART: X16.4 ; also sheet 11
PWRDIR: MCU.A1(-ADCL:ADC1) ; also sheet 11
PWRSS: MCU.A2(-ADCL:ADC2) ; also sheet 11
RTC_SELECT: MCU.8(-PWMH:8(PH5)) ; also sheet 10
SCLK: IC23.5(A4) IC26.5(A3) MCU.ICSP_SCK(-ICSP:SCK) ; also sheet 8,10,12
SYNC1: IC23.2(A1) ; also sheet 12
SYNC2: IC24.2(A1) ; also sheet 12
TEMP_ANALOG: MCU.A0(-ADCL:ADC0) ; also sheet 10
TOUCH_CS: MCU.43(-DIGITAL:43(PG0)) ; also sheet 10
TOUCH_DIN: MCU.42(-DIGITAL:42(PG1)) ; also sheet 10
TOUCH_DOUT: MCU.3(-PWML:3(PE5)) ; also sheet 10
TOUCH_IRQ: MCU.2(-PWML:2(PE4)) ; also sheet 10
TOUCH_SCLK: MCU.44(-DIGITAL:44(PL7)) ; also sheet 10
WATCHDOG: MCU.5(-PWML:5(PE3)) ; also sheet 11
WIFI_CE: MCU.4(-PWML:4(PG5)) ; also sheet 12
Unconnected: MCU.0(-PWML:0(PE0)) MCU.1(-PWML:1(PE1)) MCU.3.3V(-POWER:3V3) MCU.5V(1)(-DIGITAL:5V(1)) MCU.5V(2)(-DIGITAL:5V(2)) MCU.50(-DIGITAL:50(PL1/MISO)) MCU.51(-DIGITAL:51(PL0)) MCU.52(-DIGITAL:52(PB3/SCK)) MCU.A3(-ADCL:ADC3) MCU.A10(-ADCH:ADC10) MCU.A11(-ADCH:ADC11) MCU.A12(-ADCH:ADC12) MCU.A14(-ADCH:ADC14) MCU.A15(-ADCH:ADC15) MCU.AREF(-PWMH:AREF) MCU.ICSP_+5V(-ICSP:+5V) MCU.ICSP_RESET(-ICSP:!RESET) MCU.VIN(-POWER:VIN) SW1.1(O)

### Buses
SCLK,MOSI,MISO,!RESET
LCD_DB[8..15]
LCD_DB[0..7]

### Notes on the sheet
- Ch #1 bus isolators | Arduino board breakout
- !PWD_RST
- 26-pin SPI and power out socket (X13, X14)
- MOSI (Output) 1
- 2 Vdd (Input)
- Ch #2 bus isolators
- CS_EXPANDER (Output) 3
- 4 CS_DAC (Output)
- !RESET! (Output) 5
- 6 CS_ADC (Output)
- SCLK (Output) 7
- 8 !INT! (Input)
- MISO (Input) 9
- 10 Gnd
- AUX_USET_IN (Output) 11
- 12 Gnd
- TEMP_NTC (Input) 13
- 14 Gnd
- MCU_VCC (Output) 15
- 16 Sync (Output)
- -Vout 17
- 18 -Vout
- -Vout 19
- 20 -Vout
- Sense- (Output) 21
- 22 Sense+ (Output)
- +Vout (Input) 23
- 24 +Vout (Input)
- +Vout (Input) 25
- 26 +Vout (Input)
- 10-pin IDC connector X16
- Gnd 1
- 2 Gnd
- PWR_DIRECT (Output) 3
- 4 PWR_SSTART (Output)
- FAN_SENSE (Input) 5
- 6 FAN_PWM (Output)
- Sync (Input) 7
- 8 +5V (Input)
- Gnd 9
- 10 +5V (Input)
- I/O isolators for communication with
- post-regulator PCB, Arduino breakout
- Licensed under the TAPR Open Hardware License (www.tapr.org/OHL)

## Sheet 10 of 12
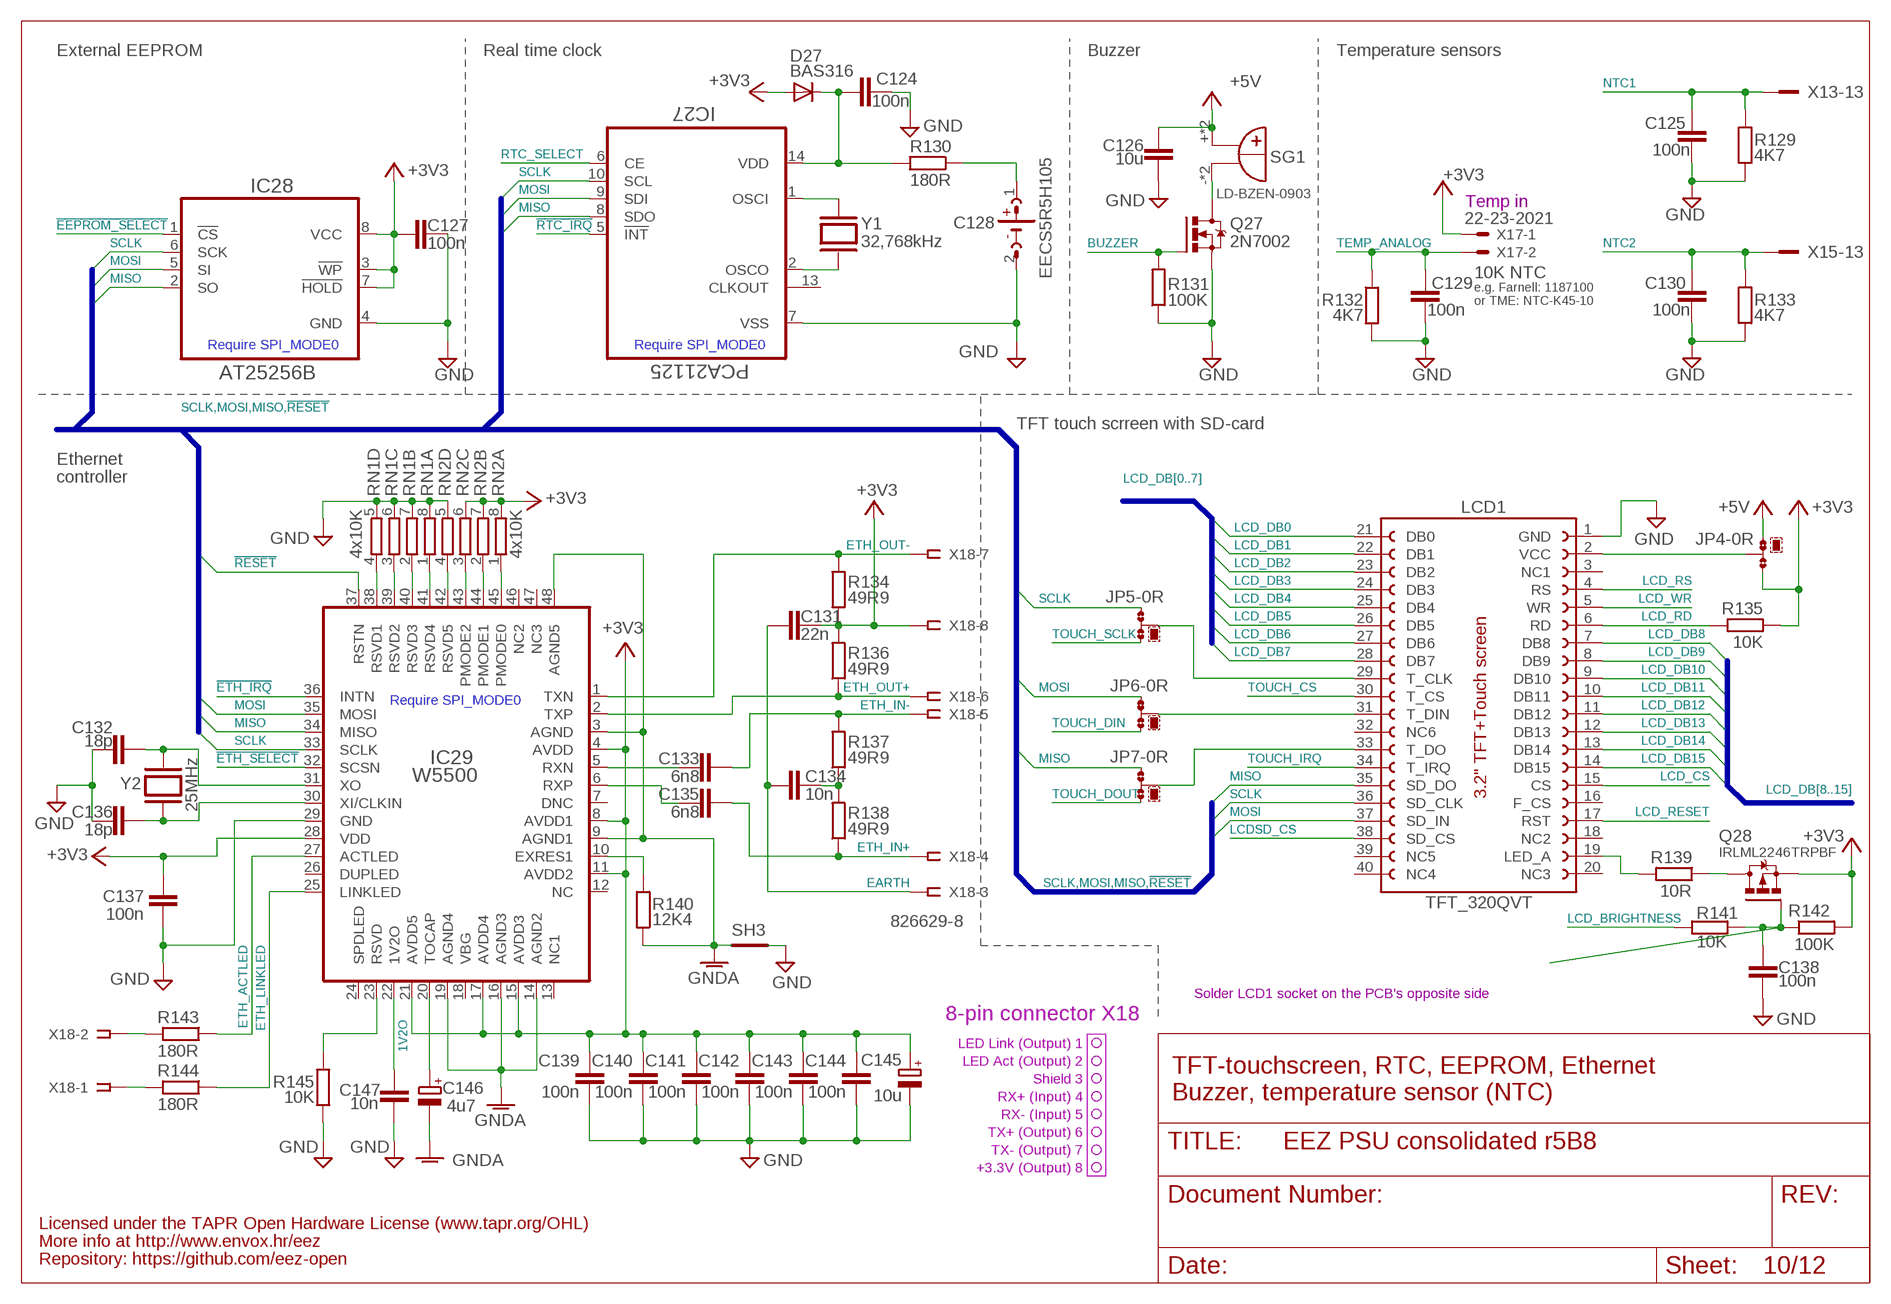
[diagram p9: schematic, sheet 10]

### Parts
C124  100n  C-EUC0603  [C0603]
C125  100n  C-EUC0603  [C0603]
C126  10u  C-EUC1206  [C1206]
C127  100n  C-EUC0603  [C0603]
C128  EECS5R5H105  SUPER_CAP  [SG-R20MM]
C129  100n  C-EUC0603  [C0603]
C130  100n  C-EUC0603  [C0603]
C131  22n  C-EUC0805  [C0805]
C132  18p  C-EUC0805  [C0805]
C133  6n8  C-EUC0603  [C0603]
C134  10n  C-EUC0805  [C0805]
C135  6n8  C-EUC0603  [C0603]
C136  18p  C-EUC0805  [C0805]
C137  100n  C-EUC0603  [C0603]
C138  100n  C-EUC0603  [C0603]
C139  100n  C-EUC0603  [C0603]
C140  100n  C-EUC0603  [C0603]
C141  100n  C-EUC0603  [C0603]
C142  100n  C-EUC0603  [C0603]
C143  100n  C-EUC0603  [C0603]
C144  100n  C-EUC0603  [C0603]
C145  10u  ECAP1206  [EC1206]
C146  4u7  ECAP1206  [EC1206]
C147  10n  C-EUC0805  [C0805]
D27  BAS316  DIODE-SOD323-W  [SOD323-W]
IC27  PCA21125  PCA21125TSSOP-14  [SOP65P640X120-14N]
IC28  AT25256B  AT25XXXSOIC8  [SOIC127P600X175-8N]
IC29  W5500  [TQFP48-7X7]
JP4  0R-JUMPA  [A0R-JMP]
JP5  0R-JUMPA  [A0R-JMP]
JP6  0R-JUMPA  [A0R-JMP]
JP7  0R-JUMPA  [A0R-JMP]
LCD1  TFT_320QVT  LCD_TFT_320QVTMIRROR  [LCD_TFT_320QVT_MIRROR]
Q27  2N7002  [SOT103P240X110-3N]
Q28  IRLML2246TRPBF  [SOT95P237X112-3N]
R129  4K7  R-EU_R0805  [R0805]
R130  180R  R-EU_R0805  [R0805]
R131  100K  R-EU_R0805  [R0805]
R132  4K7  R-EU_R0805  [R0805]
R133  4K7  R-EU_R0805  [R0805]
R134  49R9  R-EU_R0805  [R0805]
R135  10K  R-EU_R0805  [R0805]
R136  49R9  R-EU_R0805  [R0805]
R137  49R9  R-EU_R0805  [R0805]
R138  49R9  R-EU_R0805  [R0805]
R139  10R  R-EU_R0805  [R0805]
R140  12K4  R-EU_R0805  [R0805]
R141  10K  R-EU_R0805  [R0805]
R142  100K  R-EU_R0805  [R0805]
R143  180R  R-EU_R0805  [R0805]
R144  180R  R-EU_R0805  [R0805]
R145  10K  R-EU_R0805  [R0805]
RN1  4x10K  R_ARRAY4  [CAY16]
RN2  4x10K  R_ARRAY4  [CAY16]
SG1  LD-BZEN-0903  BUZZER  [BUZZER]
SH3  SHORTNOHOLE  [SHORT_NOHOLE]
X17  22-23-2021  [22-23-2021]
X18  826629-8  SSW-108-02-S-S  [SSW-108-02-S-S]
Y1  32,768kHz  XTALR26  [R26_XTAL]
Y2  25MHz  XTALSMD  [HC-49/4H]

### Nets
1V2O: C147.2 IC29.22(1V2O)
!EEPROM_SELECT: IC28.1(!CS) ; also sheet 9
!ETH_IRQ: IC29.36(INTN) ; also sheet 9,12
!ETH_SELECT: IC29.32(SCSN) ; also sheet 9,12
!RESET: IC29.37(RSTN) ; also sheet 9,11,12
!RTC_IRQ: IC27.5(!INT) ; also sheet 9
+3V3: C127.1 C131.1 C137.2 C139.1 C140.1 C141.1 C142.1 C143.1 C144.1 C145.+ D27.A IC28.3(!WP) IC28.7(!HOLD) IC28.8(VCC) IC29.4(AVDD) IC29.8(AVDD1) IC29.11(AVDD2) IC29.15(AVDD3) IC29.17(AVDD4) IC29.21(AVDD5) IC29.28(VDD) JP4.3 Q28.2(S) R134.1 R135.2 R136.2 R142.2 RN2.6 RN2.7 RN2.8 X17.1 X18.8 ; also sheet 8,9,11,12
+5V: C126.2 JP4.1 SG1.+ SG1.+B(+) ; also sheet 2,3,4,5,6,7,8,9,11,12
BUZZER: Q27.1(G) R131.2 ; also sheet 9
EARTH: C131.2 C134.2 X18.3 ; also sheet 1,8
ETH_ACTLED: IC29.27(ACTLED) R143.1
ETH_IN+: C135.1 R138.1 X18.4
ETH_IN-: C133.1 R137.2 X18.5
ETH_LINKLED: IC29.25(LINKLED) R144.1
ETH_OUT+: IC29.2(TXP) R136.1 X18.6
ETH_OUT-: IC29.1(TXN) R134.2 X18.7
GND [gnd]: C124.1 C125.1 C126.1 C127.2 C128.2(-) C129.1 C130.1 C132.2 C136.2 C137.1 C138.1 C139.2 C140.2 C141.2 C142.2 C143.2 C144.2 C145.- C147.1 IC27.7(VSS) IC28.4(GND) IC29.29(GND) LCD1.1(GND) Q27.2(S) R129.2 R131.1 R132.2 R133.2 R145.1 RN1.5 RN1.6 RN1.7 RN1.8 RN2.5 SH3.P$1(GND_A) ; also sheet 1,2,3,4,5,6,7,8,9,11,12
GNDA [gnd]: C146.- IC29.3(AGND) IC29.9(AGND1) IC29.14(AGND2) IC29.16(AGND3) IC29.19(AGND4) IC29.48(AGND5) R140.1 SH3.P$2(GND_B)
LCD_BRIGHTNESS: R141.1 ; also sheet 9
LCD_CS: LCD1.15(CS) ; also sheet 9
LCD_DB0: LCD1.21(DB0) ; also sheet 9
LCD_DB1: LCD1.22(DB1) ; also sheet 9
LCD_DB2: LCD1.23(DB2) ; also sheet 9
LCD_DB3: LCD1.24(DB3) ; also sheet 9
LCD_DB4: LCD1.25(DB4) ; also sheet 9
LCD_DB5: LCD1.26(DB5) ; also sheet 9
LCD_DB6: LCD1.27(DB6) ; also sheet 9
LCD_DB7: LCD1.28(DB7) ; also sheet 9
LCD_DB8: LCD1.7(DB8) ; also sheet 9
LCD_DB9: LCD1.8(DB9) ; also sheet 9
LCD_DB10: LCD1.9(DB10) ; also sheet 9
LCD_DB11: LCD1.10(DB11) ; also sheet 9
LCD_DB12: LCD1.11(DB12) ; also sheet 9
LCD_DB13: LCD1.12(DB13) ; also sheet 9
LCD_DB14: LCD1.13(DB14) ; also sheet 9
LCD_DB15: LCD1.14(DB15) ; also sheet 9
LCD_RD: LCD1.6(RD) R135.1
LCD_RESET: LCD1.17(RST) ; also sheet 9
LCD_RS: LCD1.4(RS) ; also sheet 9
LCD_WR: LCD1.5(WR) ; also sheet 9
LCDSD_CS: LCD1.38(SD_CS) ; also sheet 9
LED_A: LCD1.19(LED_A) R139.2
MISO: IC27.8(SDO) IC28.2(SO) IC29.34(MISO) JP7.1 LCD1.35(SD_DO) ; also sheet 9,12
MOSI: IC27.9(SDI) IC28.5(SI) IC29.35(MOSI) JP6.1 LCD1.37(SD_IN) ; also sheet 8,9,12
N$101: Q27.3(D) SG1.- SG1.-B(-)
N$102: JP4.2 LCD1.2(VCC)
N$103: Q28.3(D) R139.1
N$104: JP7.2 LCD1.33(T_DO)
N$105: JP5.2 LCD1.29(T_CLK)
N$106: JP6.2 LCD1.31(T_DIN)
N$107: C128.1(+) R130.1
N$108: IC29.23(RSVD) R145.2
N$109: C124.2 D27.C IC27.14(VDD) R130.2
N$110: IC29.10(EXRES1) R140.2
N$111: C132.1 IC29.31(XO) Y2.1
N$112: C136.1 IC29.30(XI/CLKIN) Y2.2
N$113: C133.2 IC29.5(RXN)
N$115: C135.2 IC29.6(RXP)
N$116: R144.2 X18.1
N$118: R143.2 X18.2
N$119: IC29.43(PMODE2) RN2.3
N$120: IC29.44(PMODE1) RN2.2
N$121: IC29.45(PMODE0) RN2.1
N$122: IC29.42(RSVD5) RN2.4
N$123: IC29.38(RSVD1) RN1.4
N$124: C134.1 R137.1 R138.2
N$126: IC29.39(RSVD2) RN1.3
N$127: IC29.41(RSVD4) RN1.1
N$130: IC29.40(RSVD3) RN1.2
N$132: C138.2 Q28.1(G) R141.2 R142.1
N$133: IC27.1(OSCI) Y1.2
N$134: IC27.2(OSCO) Y1.1
NTC1: C125.2 R129.1 X13.13 ; also sheet 9
NTC2: C130.2 R133.1 X15.13 ; also sheet 9
RTC_SELECT: IC27.6(CE) ; also sheet 9
SCLK: IC27.10(SCL) IC28.6(SCK) IC29.33(SCLK) JP5.1 LCD1.36(SD_CLK) ; also sheet 8,9,12
TEMP_ANALOG: C129.2 R132.1 X17.2 ; also sheet 9
TOCAP: C146.+ IC29.20(TOCAP)
TOUCH_CS: LCD1.30(T_CS) ; also sheet 9
TOUCH_DIN: JP6.3 ; also sheet 9
TOUCH_DOUT: JP7.3 ; also sheet 9
TOUCH_IRQ: LCD1.34(T_IRQ) ; also sheet 9
TOUCH_SCLK: JP5.3 ; also sheet 9
Unconnected: IC27.13(CLKOUT) IC29.7(DNC) IC29.12(NC) IC29.13(NC1) IC29.18(VBG) IC29.24(SPDLED) IC29.26(DUPLED) IC29.46(NC2) IC29.47(NC3) LCD1.3(NC1) LCD1.16(F_CS) LCD1.18(NC2) LCD1.20(NC3) LCD1.32(NC6) LCD1.39(NC5) LCD1.40(NC4)

### Buses
SCLK,MOSI,MISO,!RESET
LCD_DB[0..7]
LCD_DB[8..15]

### Notes on the sheet
- External EEPROM | Real time clock | Buzzer | Temperature sensors
- Temp in
- 10K NTC
- e.g. Farnell: 1187100
- or TME: NTC-K45-10
- Require SPI_MODE0 | Require SPI_MODE0
- TFT touch scrreen with SD-card
- Ethernet
- controller
- Require SPI_MODE0
- Solder LCD1 socket on the PCB's opposite side
- 8-pin connector X18
- LED Link (Output) 1
- LED Act (Output) 2
- Shield 3 | TFT-touchscreen, RTC, EEPROM, Ethernet
- RX+ (Input) 4
- Buzzer, temperature sensor (NTC)
- RX- (Input) 5
- TX+ (Output) 6
- TX- (Output) 7
- +3.3V (Output) 8
- Licensed under the TAPR Open Hardware License (www.tapr.org/OHL)
- More info at http://www.envox.hr/eez
- Repository: https://github.com/eez-open